# Altium project EXP_V100.PrjPcb
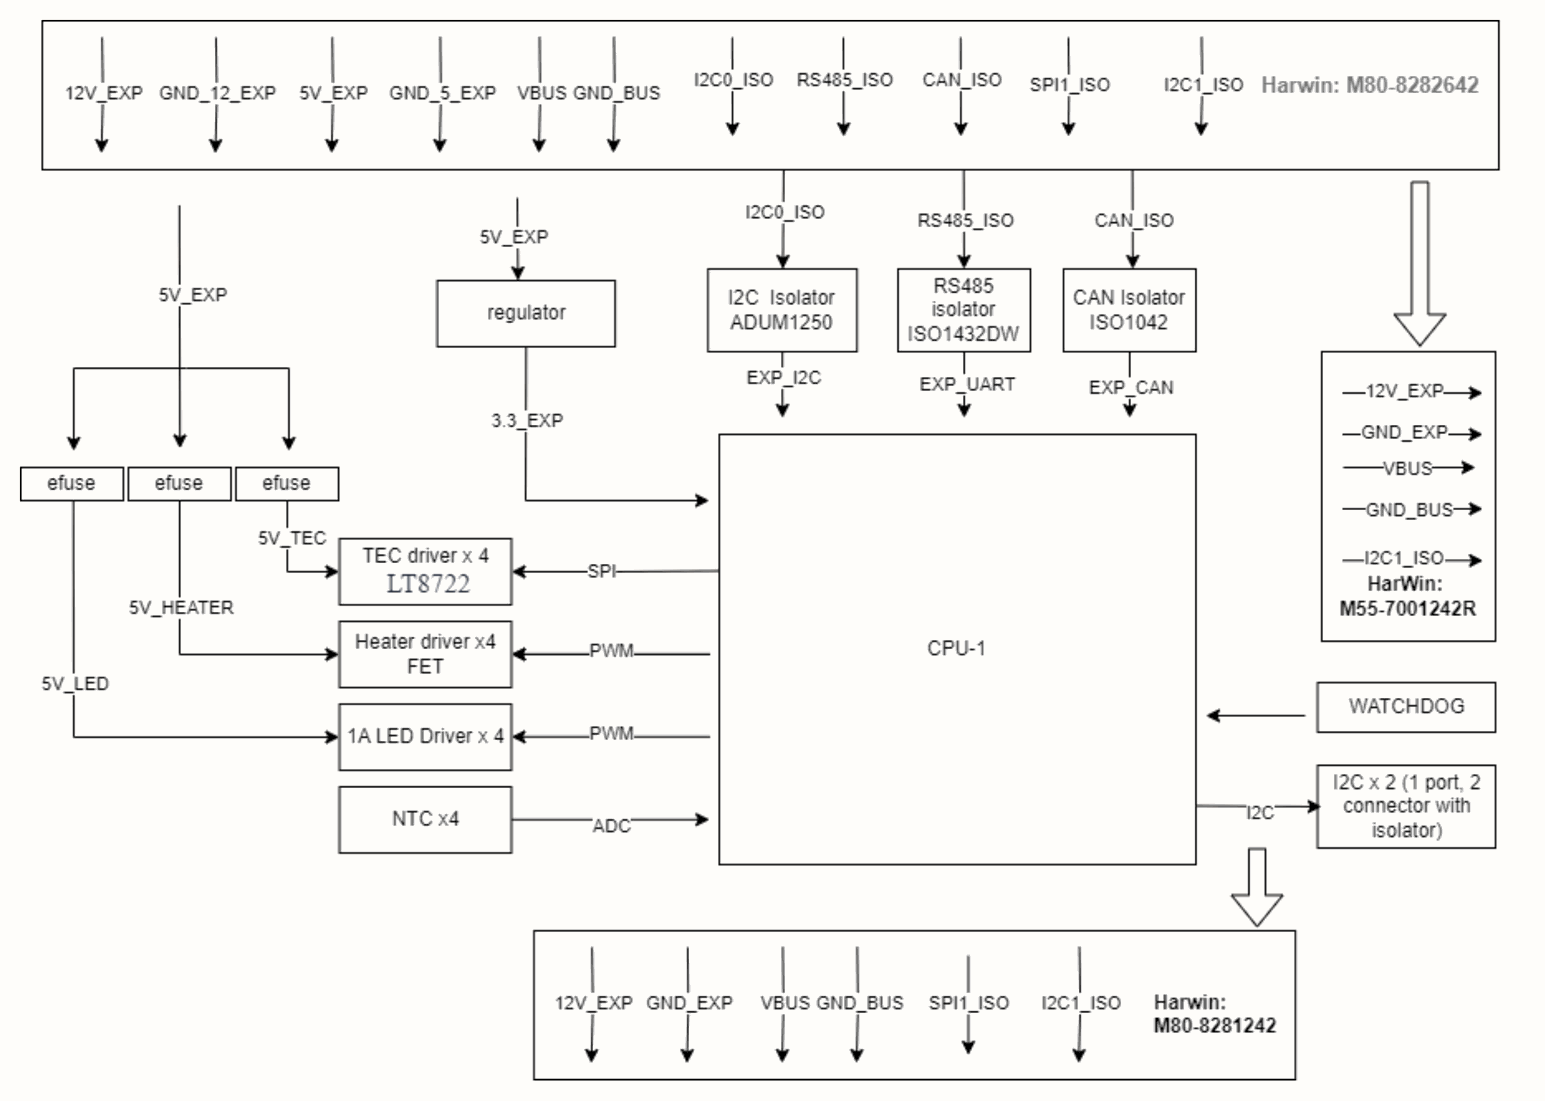
[diagram p0: BLOCK_DIAGRAM.SchDoc]
11 sheets, 411 parts. Net scope: global (net labels, ports and power ports of the same name join across sheets).
Board file: EXP_V100_1.PcbDoc
Sheets:
  BLOCK_DIAGRAM.SchDoc
  INDEX.SchDoc
  HEADERSchDoc.SchDoc
  POWERchDoc.SchDoc
  ISO_COMMUNICATION.SchDoc
  TECS_DRIVER.SchDoc
  HEATER.SchDoc
  NTC.SchDoc
  I2C_SENSOR.SchDoc
  LED.SchDoc
  MCU.SchDoc

## Sheet BLOCK_DIAGRAM.SchDoc: BLOCK_DIAGRAM
size 420 x 297 mm; SheetNumber: 1; SheetTotal: 11

### Notes on the sheet
- Project:
- BEE-PC1
- Sub-system:
- NANORACK_EXP_CONTROLLER
- Design by:
- SANG HUYNH
- BAO BUI Q.
- Sheet title:
- Sheet
- A3
- of
- Checked by:
- Approved by:
- VU PHAM
- Revision:
- Document No:
- V1.0.0
- Size:
- Date:
- 01/10/2024

## Sheet INDEX.SchDoc: INDEX
size 420 x 297 mm; CheckedBy: BAO BUI Q.; Author: SANG HUYNH; DocumentNumber: 1; Revision: V1.0.0; SheetNumber: 2; SheetTotal: 11
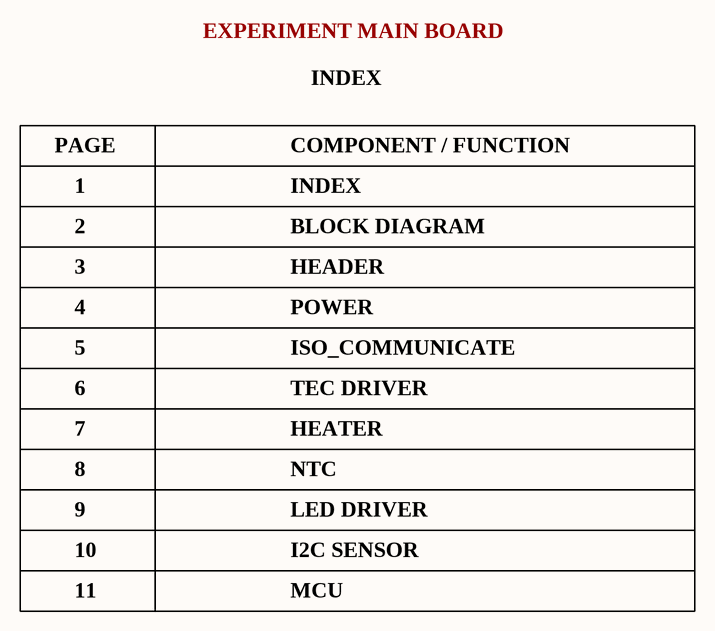
[diagram p1: INDEX.SchDoc]

### Notes on the sheet
- EXPERIMENT MAIN BOARD
- PAGE
- COMPONENT / FUNCTION
- INDEX
- 1
- 2
- 3
- BLOCK DIAGRAM
- HEADER
- 4
- POWER
- 5
- 6
- ISO_COMMUNICATE
- TEC DRIVER
- 7
- 8
- HEATER
- NTC
- 9
- 10
- LED DRIVER
- I2C SENSOR
- 11
- MCU
- Project:
- BEE-PC1
- Sub-system:
- NANORACK_EXP_CONTROLLER
- Design by:
- SANG HUYNH
- BAO BUI Q.
- Sheet title:
- Sheet
- A3
- of
- Checked by:
- Approved by:
- VU PHAM
- Revision:
- Document No:
- V1.0.0
- Size:
- Date:
- 01/10/2024

## Sheet HEADERSchDoc.SchDoc: HEADER
size 420 x 297 mm; SheetNumber: 3; SheetTotal: 11
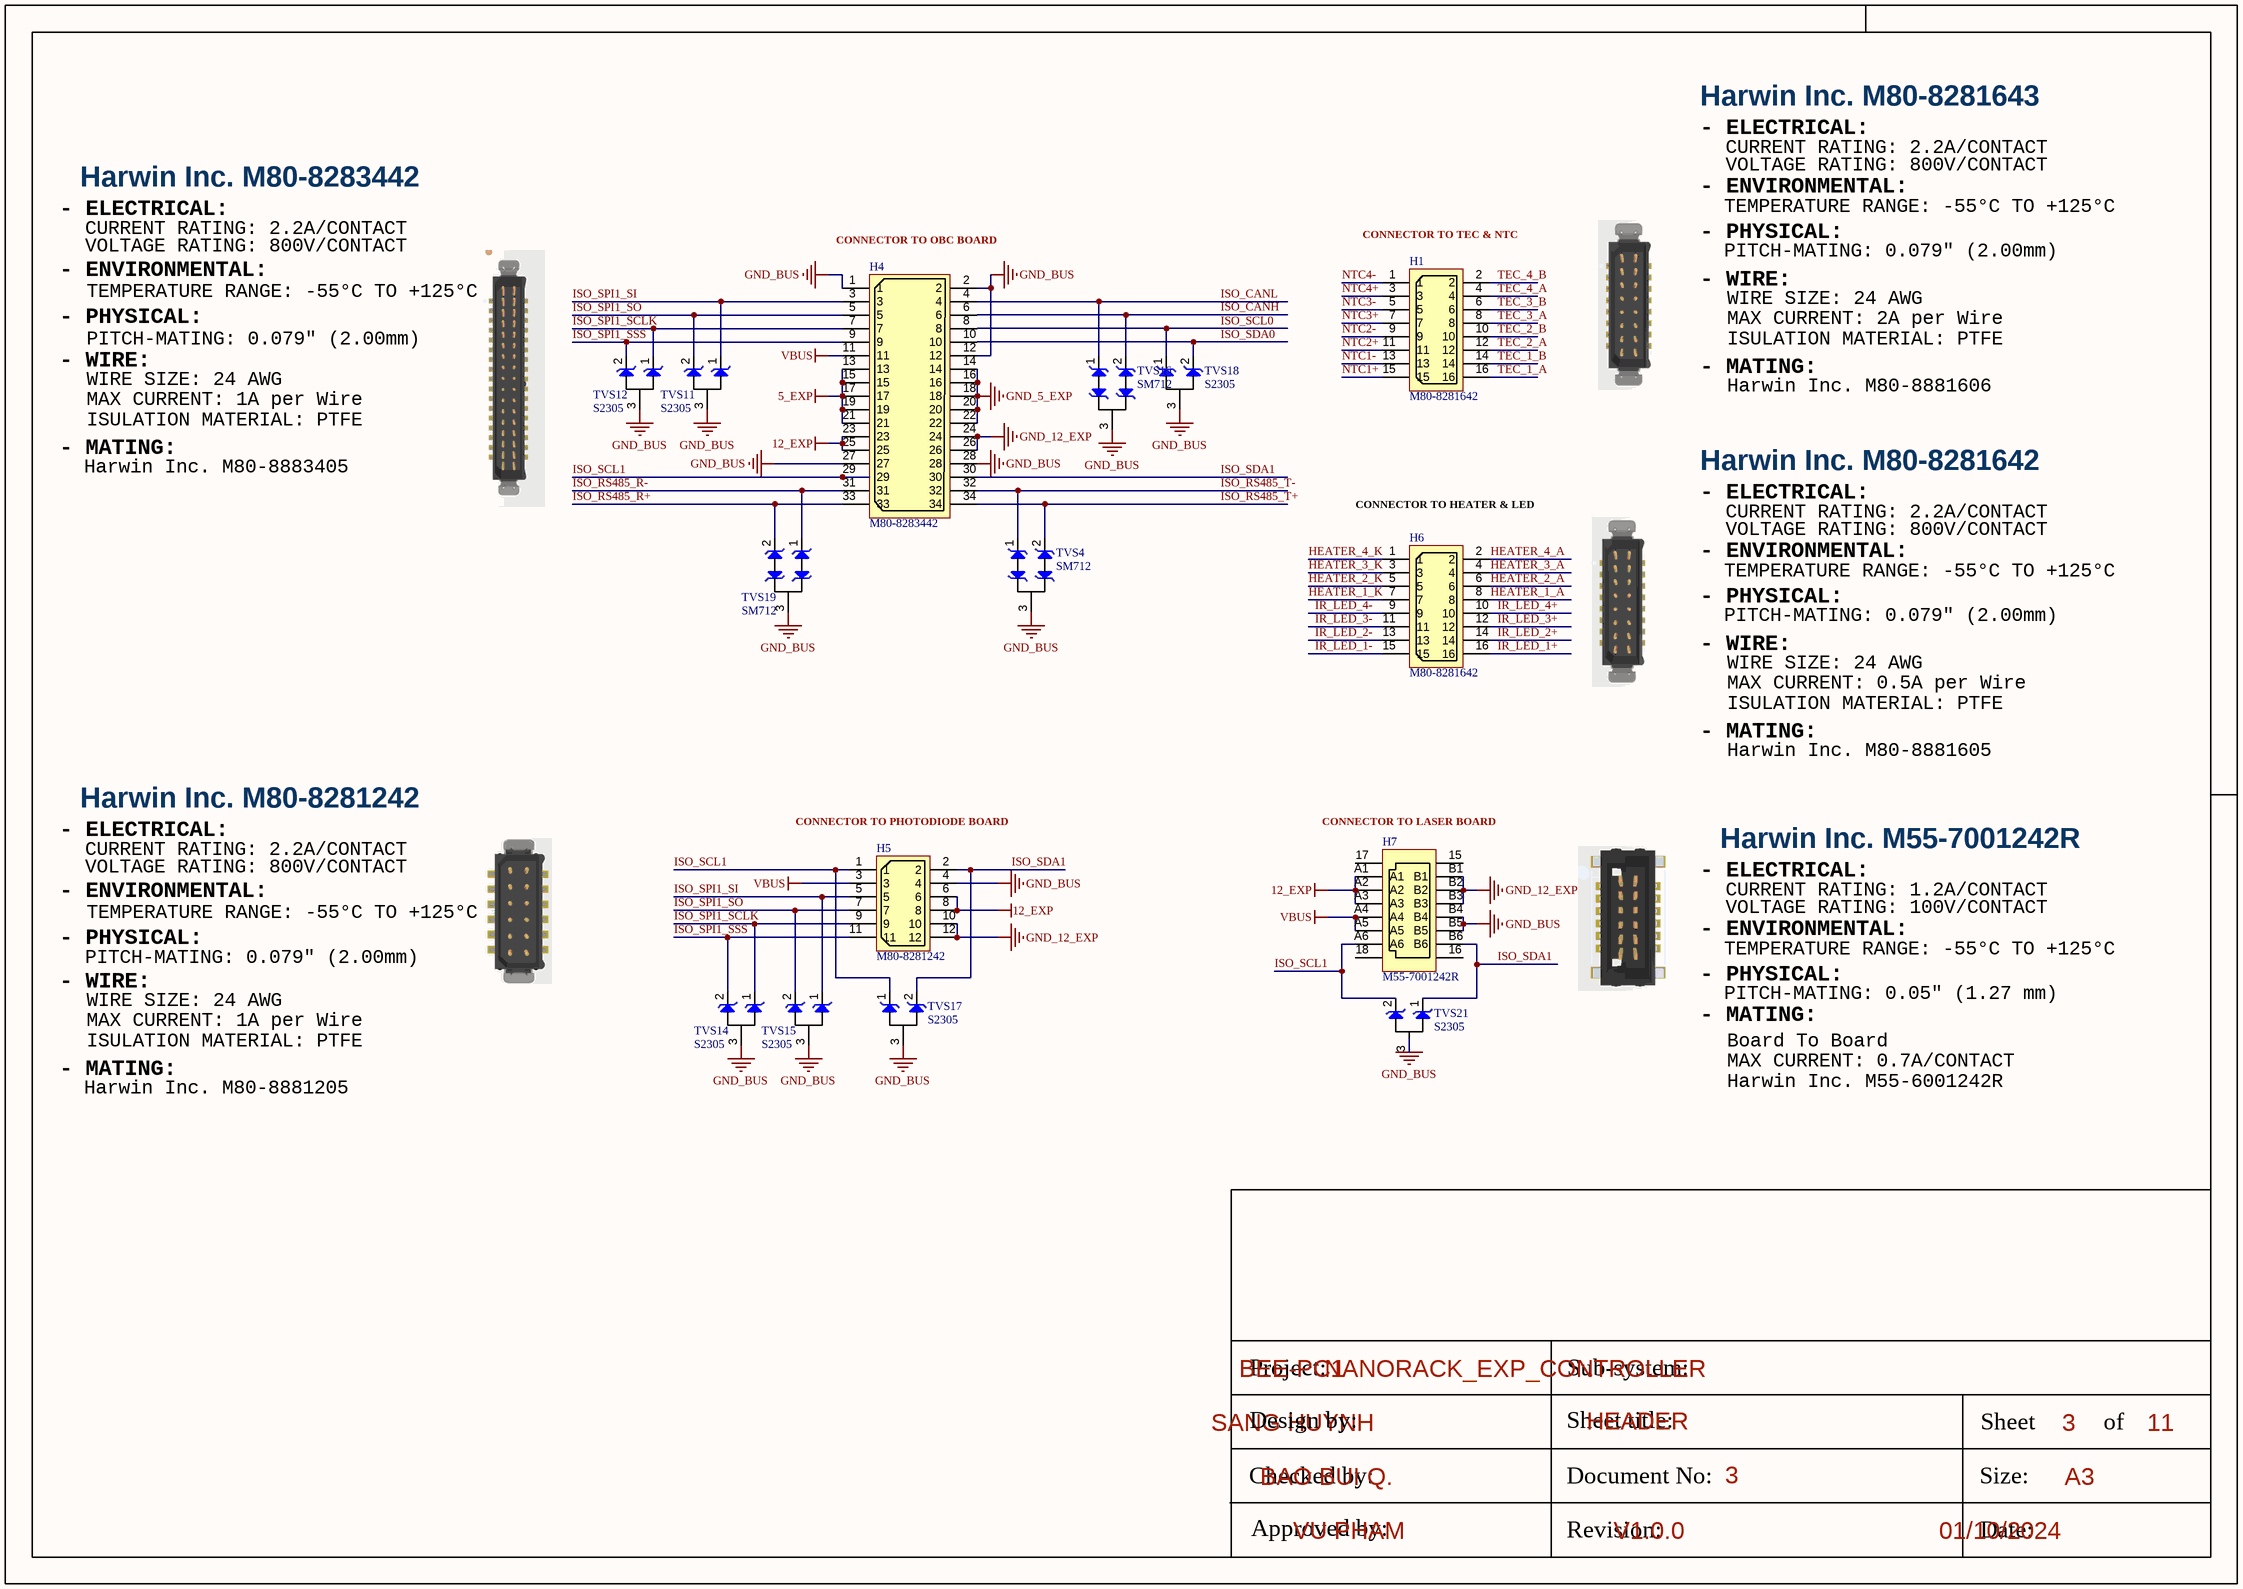
[diagram p2: HEADERSchDoc.SchDoc]

### Parts
H1  M80-8281642  [M80-8281642]
H4  M80-8283442  [M80-8283442]
H5  M80-8281242  [M80-8281242]
H6  M80-8281642  [M80-8281642]
H7  M55-7001242R  [M55-7001242R]
TVS4  SM712  [SOT23-12_3]
TVS11  S2305  [sot23-12_3]
TVS12  S2305  [sot23-12_3]
TVS14  S2305  [sot23-12_3]
TVS15  S2305  [sot23-12_3]
TVS16  SM712  [SOT23-12_3]
TVS17  S2305  [sot23-12_3]
TVS18  S2305  [sot23-12_3]
TVS19  SM712  [SOT23-12_3]
TVS21  S2305  [sot23-12_3]

### Nets
5_EXP: H4.13 H4.15 H4.17 H4.19 H4.21  [project net +5]
12_EXP: H4.23 H4.25 H5.6 H5.8 H7.A1 H7.A2 H7.A3
GND_5_EXP: H4.14 H4.16 H4.18 H4.20 H4.22  [project net GND]
GND_12_EXP: H4.24 H4.26 H5.10 H5.12 H7.B1 H7.B2 H7.B3
GND_BUS: H4.1 H4.2 H4.12 H4.27 H4.28 H5.4 H7.B4 H7.B5 TVS4.3 TVS11.3 TVS12.3 TVS14.3 TVS15.3 TVS16.3 TVS17.3 TVS18.3 TVS19.3 TVS21.3
NTC1+: H1.3 H1.7 H1.11 H1.15  [also labelled NTC2+, NTC3+, NTC4+]  [project net 3V3_EXP]
VBUS: H4.11 H5.3 H7.A4 H7.A5
HEATER_1_A: H6.8
HEATER_1_K: H6.7
HEATER_2_A: H6.6
HEATER_2_K: H6.5
HEATER_3_A: H6.4
HEATER_3_K: H6.3
HEATER_4_A: H6.2
HEATER_4_K: H6.1
IR_LED_1+: H6.16
IR_LED_1-: H6.15
IR_LED_2+: H6.14
IR_LED_2-: H6.13
IR_LED_3+: H6.12
IR_LED_3-: H6.11
IR_LED_4+: H6.10
IR_LED_4-: H6.9
ISO_CANH: H4.6 TVS16.2
ISO_CANL: H4.4 TVS16.1
ISO_RS485_R+: H4.33 TVS19.2
ISO_RS485_R-: H4.31 TVS19.1
ISO_RS485_T+: H4.34 TVS4.2
ISO_RS485_T-: H4.32 TVS4.1
ISO_SCL0: H4.8 TVS18.1
ISO_SCL1: H4.29 H5.1 H7.A6 TVS17.1 TVS21.2
ISO_SDA0: H4.10 TVS18.2
ISO_SDA1: H4.30 H5.2 H7.B6 TVS17.2 TVS21.1
ISO_SPI1_~{SSS}: H4.9 H5.11 TVS12.2 TVS14.2
ISO_SPI1_SCLK: H4.7 H5.9 TVS12.1 TVS14.1
ISO_SPI1_SI: H4.3 H5.5 TVS11.1 TVS15.1
ISO_SPI1_SO: H4.5 H5.7 TVS11.2 TVS15.2
NTC1-: H1.13
NTC2-: H1.9
NTC3-: H1.5
NTC4-: H1.1
TEC_1_A: H1.16
TEC_1_B: H1.14
TEC_2_A: H1.12
TEC_2_B: H1.10
TEC_3_A: H1.8
TEC_3_B: H1.6
TEC_4_A: H1.4
TEC_4_B: H1.2

Not connected (* = marked no-connect by the designer): H7 15 16 17 18

### Notes on the sheet
- Harwin Inc. M80-8281643
- Harwin Inc. M80-8283442
- - ELECTRICAL:
- - ENVIRONMENTAL:
- CURRENT RATING: 2.2A/CONTACT
- VOLTAGE RATING: 800V/CONTACT
- (near H4) CONNECTOR TO OBC BOARD
- (near H1) CONNECTOR TO TEC & NTC
- - PHYSICAL:
- TEMPERATURE RANGE: -55°C TO +125°C
- PITCH-MATING: 0.079" (2.00mm)
- - WIRE:
- WIRE SIZE: 24 AWG
- MAX CURRENT: 2A per Wire
- - MATING:
- Harwin Inc. M80-8881606
- ISULATION MATERIAL: PTFE
- MAX CURRENT: 1A per Wire
- Harwin Inc. M80-8883405
- (near H6) CONNECTOR TO HEATER & LED
- Harwin Inc. M80-8281642
- MAX CURRENT: 0.5A per Wire
- Harwin Inc. M80-8881605
- Harwin Inc. M80-8281242
- (near H5) CONNECTOR TO PHOTODIODE BOARD
- (near H7) CONNECTOR TO LASER BOARD
- Harwin Inc. M55-7001242R
- CURRENT RATING: 1.2A/CONTACT
- VOLTAGE RATING: 100V/CONTACT
- PITCH-MATING: 0.05" (1.27 mm)
- Board To Board
- MAX CURRENT: 0.7A/CONTACT
- Harwin Inc. M80-8881205
- Harwin Inc. M55-6001242R
- Project:
- BEE-PC1
- Sub-system:
- NANORACK_EXP_CONTROLLER
- Design by:
- SANG HUYNH
- BAO BUI Q.
- Sheet title:
- Sheet
- A3
- of
- Checked by:
- Approved by:
- VU PHAM
- Revision:
- Document No:
- V1.0.0
- Size:
- Date:
- 01/10/2024

### Library data of the parts
H1 H6 = M80-8281642: CONN HEADER SMD 16POS 2MM
H4 = M80-8283442: CONN HEADER SMD 34POS 2MM
H5 = M80-8281242: CONN HEADER SMD 12POS 2MM
H7 = M55-7001242R: CONN HEADER SMD 12POS 1.27MM
TVS4 TVS16 TVS19 = SM712: 7V/12V TVS,PACKAGE SOT-23, TVS A
TVS11 TVS12 TVS14 TVS15 TVS17 TVS18 TVS21 = S2305: TVS DIODE 5VWM 10.8VC SOT23

## Sheet POWERchDoc.SchDoc: POWER
size 420 x 297 mm; SheetNumber: 4; SheetTotal: 11
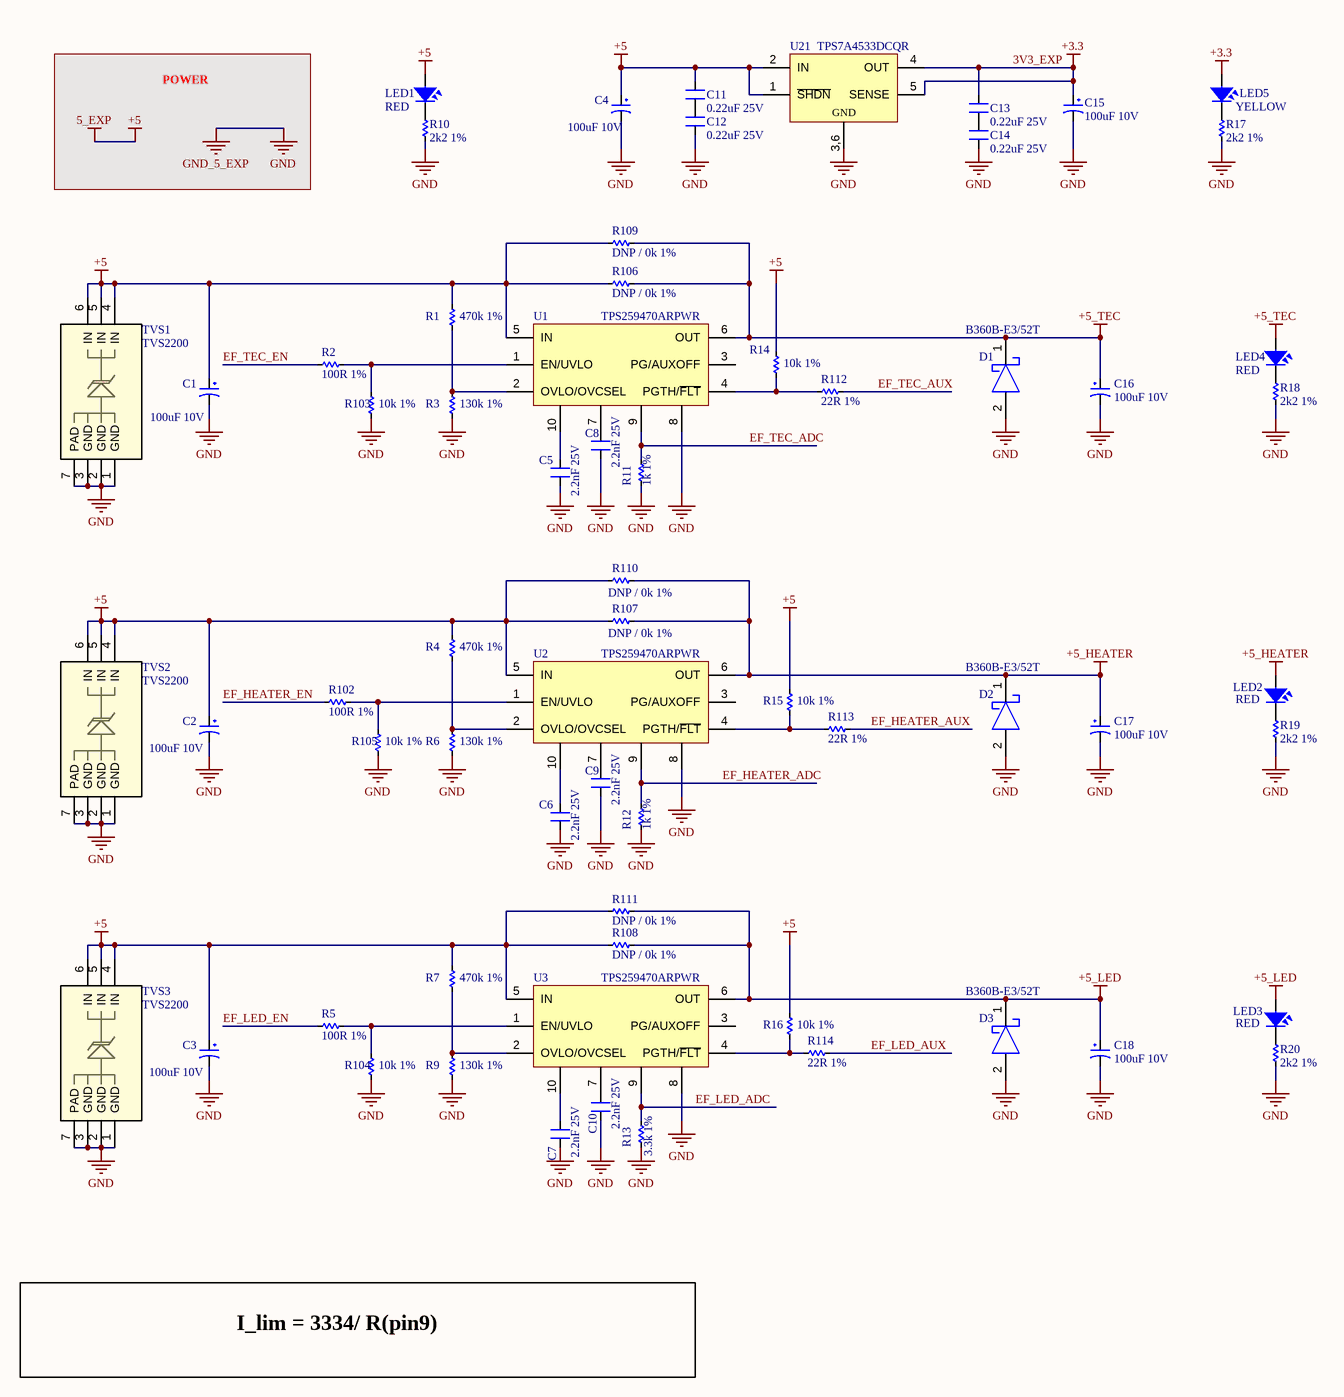
[diagram p3: POWERchDoc.SchDoc]

### Parts
C1  100uF 10V  [TANTALUM_SMD_1206]
C2  100uF 10V  [TANTALUM_SMD_1206]
C3  100uF 10V  [TANTALUM_SMD_1206]
C4  100uF 10V  [TANTALUM_SMD_1206]
C5  2.2nF 25V  [CN-SMD-0603]
C6  2.2nF 25V  [CN-SMD-0603]
C7  2.2nF 25V  [CN-SMD-0603]
C8  2.2nF 25V  [CN-SMD-0603]
C9  2.2nF 25V  [CN-SMD-0603]
C10  2.2nF 25V  [CN-SMD-0603]
C11  0.22uF 25V  [CN-SMD-0603]
C12  0.22uF 25V  [CN-SMD-0603]
C13  0.22uF 25V  [CN-SMD-0603]
C14  0.22uF 25V  [CN-SMD-0603]
C15  100uF 10V  [TANTALUM_SMD_1206]
C16  100uF 10V  [TANTALUM_SMD_1206]
C17  100uF 10V  [TANTALUM_SMD_1206]
C18  100uF 10V  [TANTALUM_SMD_1206]
D1  B360B-E3/52T  [DO214]
D2  B360B-E3/52T  [DO214]
D3  B360B-E3/52T  [DO214]
LED1  RED  [LED_0603_RED]
LED2  RED  [LED_0603_RED]
LED3  RED  [LED_0603_RED]
LED4  RED  [LED_0603_RED]
LED5  YELLOW  [LED_0603_RED]
R1  470k 1%  [RES-SMD-0603]
R2  100R 1%  [RES-SMD-0603]
R3  130k 1%  [RES-SMD-0603]
R4  470k 1%  [RES-SMD-0603]
R5  100R 1%  [RES-SMD-0603]
R6  130k 1%  [RES-SMD-0603]
R7  470k 1%  [RES-SMD-0603]
R9  130k 1%  [RES-SMD-0603]
R10  2k2 1%  [RES-SMD-0603]
R11  1k 1%  [RES-SMD-0603]
R12  1k 1%  [RES-SMD-0603]
R13  3.3k 1%  [RES-SMD-0603]
R14  10k 1%  [RES-SMD-0603]
R15  10k 1%  [RES-SMD-0603]
R16  10k 1%  [RES-SMD-0603]
R17  2k2 1%  [RES-SMD-0603]
R18  2k2 1%  [RES-SMD-0603]
R19  2k2 1%  [RES-SMD-0603]
R20  2k2 1%  [RES-SMD-0603]
R102  100R 1%  [RES-SMD-0603]
R103  10k 1%  [RES-SMD-0603]
R104  10k 1%  [RES-SMD-0603]
R105  10k 1%  [RES-SMD-0603]
R106  DNP / 0k 1%  [RES-SMD-0603]
R107  DNP / 0k 1%  [RES-SMD-0603]
R108  DNP / 0k 1%  [RES-SMD-0603]
R109  DNP / 0k 1%  [RES-SMD-0603]
R110  DNP / 0k 1%  [RES-SMD-0603]
R111  DNP / 0k 1%  [RES-SMD-0603]
R112  22R 1%  [RES-SMD-0603]
R113  22R 1%  [RES-SMD-0603]
R114  22R 1%  [RES-SMD-0603]
TVS1  TVS2200  [TVS2200]
TVS2  TVS2200  [TVS2200]
TVS3  TVS2200  [TVS2200]
U1  TPS259470ARPWR  [VQFN-HR-10]
U2  TPS259470ARPWR  [VQFN-HR-10]
U3  TPS259470ARPWR  [VQFN-HR-10]
U21  TPS7A4533DCQR  [SOT223_6]

### Nets
3V3_EXP: C13.2 C15.1 LED5.1 U21.4(OUT) U21.5(SENSE)  [also labelled +3.3]
+5: C1.1 C2.1 C3.1 C4.1 C11.2 LED1.1 R1.1 R4.1 R7.1 R14.1 R15.1 R16.1 R106.2 R107.2 R108.2 R109.2 R110.2 R111.2 TVS1.4(IN) TVS1.5(IN) TVS1.6(IN) TVS2.4(IN) TVS2.5(IN) TVS2.6(IN) TVS3.4(IN) TVS3.5(IN) TVS3.6(IN) U1.5(IN) U2.5(IN) U3.5(IN) U21.1(~{SHDN}) U21.2(IN)  [also labelled 5_EXP]
+5_HEATER: C17.1 D2.1 LED2.1 R107.1 R110.1 U2.6(OUT)
+5_LED: C18.1 D3.1 LED3.1 R108.1 R111.1 U3.6(OUT)
+5_TEC: C16.1 D1.1 LED4.1 R106.1 R109.1 U1.6(OUT)
GND: C1.2 C2.2 C3.2 C4.2 C5.1 C6.1 C7.1 C8.1 C9.1 C10.1 C12.1 C14.1 C15.2 C16.2 C17.2 C18.2 D1.2 D2.2 D3.2 R3.2 R6.2 R9.2 R10.2 R11.2 R12.2 R13.2 R17.2 R18.2 R19.2 R20.2 R103.2 R104.2 R105.2 TVS1.1(GND) TVS1.2(GND) TVS1.3(GND) TVS1.7(PAD) TVS2.1(GND) TVS2.2(GND) TVS2.3(GND) TVS2.7(PAD) TVS3.1(GND) TVS3.2(GND) TVS3.3(GND) TVS3.7(PAD) U1.8 U2.8 U3.8 U21.3,6(GND)  [also labelled GND_5_EXP]
EF_HEATER_ADC: R12.1 U2.9
EF_HEATER_AUX: R113.2
EF_HEATER_EN: R102.1
EF_LED_ADC: R13.1 U3.9
EF_LED_AUX: R114.2
EF_LED_EN: R5.1
EF_TEC_ADC: R11.1 U1.9
EF_TEC_AUX: R112.2
EF_TEC_EN: R2.1
NetC5_2: C5.2 U1.10
NetC6_2: C6.2 U2.10
NetC7_2: C7.2 U3.10
NetC8_2: C8.2 U1.7
NetC9_2: C9.2 U2.7
NetC10_2: C10.2 U3.7
NetC11_1: C11.1 C12.2
NetC13_1: C13.1 C14.2
NetLED1_2: LED1.2 R10.1
NetLED2_2: LED2.2 R19.1
NetLED3_2: LED3.2 R20.1
NetLED4_2: LED4.2 R18.1
NetLED5_2: LED5.2 R17.1
NetR1_2: R1.2 R3.1 U1.2(OVLO/OVCSEL)
NetR2_2: R2.2 R103.1 U1.1(EN/UVLO)
NetR4_2: R4.2 R6.1 U2.2(OVLO/OVCSEL)
NetR5_2: R5.2 R104.1 U3.1(EN/UVLO)
NetR7_2: R7.2 R9.1 U3.2(OVLO/OVCSEL)
NetR14_2: R14.2 R112.1 U1.4(PGTH/~{FLT})
NetR15_2: R15.2 R113.1 U2.4(PGTH/~{FLT})
NetR16_2: R16.2 R114.1 U3.4(PGTH/~{FLT})
NetR102_2: R102.2 R105.1 U2.1(EN/UVLO)

Not connected (* = marked no-connect by the designer): U1 3(PG/AUXOFF); U2 3(PG/AUXOFF); U3 3(PG/AUXOFF)

### Notes on the sheet
- POWER
- I_lim = 3334/ R(pin9)
- Project:
- BEE-PC1
- Sub-system:
- NANORACK_EXP_CONTROLLER
- Design by:
- SANG HUYNH
- BAO BUI Q.
- Sheet title:
- Sheet
- A3
- of
- Checked by:
- Approved by:
- VU PHAM
- Revision:
- Document No:
- V1.0.0
- Size:
- Date:
- 01/10/2024

### Library data of the parts
C1-C4 C15-C18 = Cap_Tantalum SMD: SMD; Chung_Loai: Dán; Don_Vi: Con; So_Chan: 2; Ten_Linh_Kien: Tụ tantalum 477A-470uF 10V SMD7343; Ma_Hang: MH001956; Kieu_Chan: *
C5-C14 = Capacitors: Value: 33pF
D1-D3 = B360B-E3/52T: DIODE SCHOTTKY 60V 3A DO214AA
LED1-LED5 = LED SMD: Value: LED 3 - 5 ly 2 Colour
R1-R7 R9-R20 R102-R114 = Res SMD: SMD; Manufacturer: Generic Components; Class: Passive; Published: 08/06/2000; Publisher: Altium Hobart Technology Centre
TVS1-TVS3 = TVS2200: UNIDIR PRECISION SURGE DIODE
U21 = TPS7A4533DCQR: IC REG LINEAR 3.3V 1.5A SOT223-6

## Sheet ISO_COMMUNICATION.SchDoc: ISO_COMMUNICATION
size 420 x 297 mm; SheetNumber: 5; SheetTotal: 11
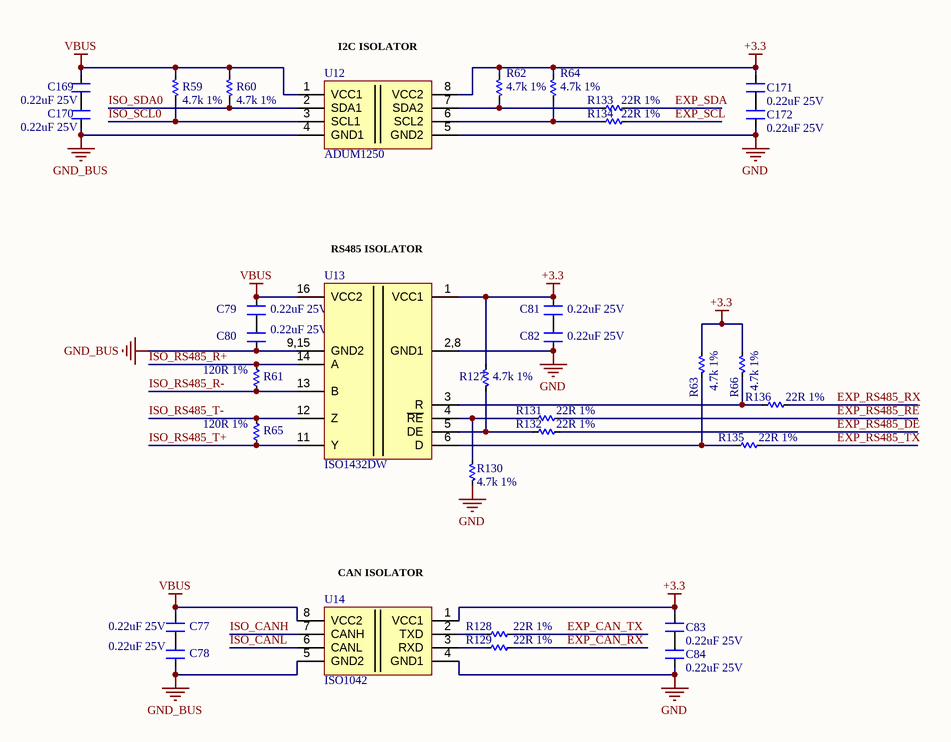
[diagram p4: ISO_COMMUNICATION.SchDoc]

### Parts
C77  0.22uF 25V  [CN-SMD-0603]
C78  0.22uF 25V  [CN-SMD-0603]
C79  0.22uF 25V  [CN-SMD-0603]
C80  0.22uF 25V  [CN-SMD-0603]
C81  0.22uF 25V  [CN-SMD-0603]
C82  0.22uF 25V  [CN-SMD-0603]
C83  0.22uF 25V  [CN-SMD-0603]
C84  0.22uF 25V  [CN-SMD-0603]
C169  0.22uF 25V  [CN-SMD-0603]
C170  0.22uF 25V  [CN-SMD-0603]
C171  0.22uF 25V  [CN-SMD-0603]
C172  0.22uF 25V  [CN-SMD-0603]
R59  4.7k 1%  [RES-SMD-0603]
R60  4.7k 1%  [RES-SMD-0603]
R61  120R 1%  [RES-SMD-0603]
R62  4.7k 1%  [RES-SMD-0603]
R63  4.7k 1%  [RES-SMD-0603]
R64  4.7k 1%  [RES-SMD-0603]
R65  120R 1%  [RES-SMD-0603]
R66  4.7k 1%  [RES-SMD-0603]
R127  4.7k 1%  [RES-SMD-0603]
R128  22R 1%  [RES-SMD-0603]
R129  22R 1%  [RES-SMD-0603]
R130  4.7k 1%  [RES-SMD-0603]
R131  22R 1%  [RES-SMD-0603]
R132  22R 1%  [RES-SMD-0603]
R133  22R 1%  [RES-SMD-0603]
R134  22R 1%  [RES-SMD-0603]
R135  22R 1%  [RES-SMD-0603]
R136  22R 1%  [RES-SMD-0603]
U12  ADUM1250  [SOIC-8]
U13  ISO1432DW  [SOIC-16]
U14  ISO1042  [SOIC-8]

### Nets
+3.3: C81.2 C83.2 C171.2 R62.2 R63.2 R64.2 R66.2 R127.2 U12.8(VCC2) U13.1(VCC1) U14.1(VCC1)  [project net 3V3_EXP]
GND: C82.1 C84.1 C172.1 R130.2 U12.5(GND2) U13.2,8(GND1) U14.4(GND1)
GND_BUS: C78.1 C80.1 C170.1 U12.4(GND1) U13.9,15(GND2) U14.5(GND2)
VBUS: C77.2 C79.2 C169.2 R59.2 R60.2 U12.1(VCC1) U13.16(VCC2) U14.8(VCC2)
EXP_CAN_RX: R129.2
EXP_CAN_TX: R128.2
EXP_RS485_DE: R132.2
EXP_RS485_~{RE}: R131.2
EXP_RS485_RX: R136.2
EXP_RS485_TX: R135.2
EXP_SCL: R134.2
EXP_SDA: R133.2
ISO_CANH: U14.7(CANH)
ISO_CANL: U14.6(CANL)
ISO_RS485_R+: R61.2 U13.14(A)
ISO_RS485_R-: R61.1 U13.13(B)
ISO_RS485_T+: R65.1 U13.11(Y)
ISO_RS485_T-: R65.2 U13.12(Z)
ISO_SCL0: R59.1 U12.3(SCL1)
ISO_SDA0: R60.1 U12.2(SDA1)
NetC77_1: C77.1 C78.2
NetC79_1: C79.1 C80.2
NetC81_1: C81.1 C82.2
NetC83_1: C83.1 C84.2
NetC169_1: C169.1 C170.2
NetC171_1: C171.1 C172.2
NetR62_1: R62.1 R133.1 U12.7(SDA2)
NetR63_1: R63.1 R135.1 U13.6(D)
NetR64_1: R64.1 R134.1 U12.6(SCL2)
NetR66_1: R66.1 R136.1 U13.3(R)
NetR127_1: R127.1 R132.1 U13.5(DE)
NetR128_1: R128.1 U14.2(TXD)
NetR129_1: R129.1 U14.3(RXD)
NetR130_1: R130.1 R131.1 U13.4(~{RE})

### Notes on the sheet
- (near U12) I2C ISOLATOR
- (near U13) RS485 ISOLATOR
- (near U14) CAN ISOLATOR
- Project:
- BEE-PC1
- Sub-system:
- NANORACK_EXP_CONTROLLER
- Design by:
- SANG HUYNH
- BAO BUI Q.
- Sheet title:
- Sheet
- A3
- of
- Checked by:
- Approved by:
- VU PHAM
- Revision:
- Document No:
- V1.0.0
- Size:
- Date:
- 01/10/2024

### Library data of the parts
C77-C84 C169-C172 = Capacitors: Value: 33pF
R59-R66 R127-R136 = Res SMD: as R1 on sheet POWERchDoc; Published: 08/06/2000; Publisher: Altium Hobart Technology Centre
U13 = ISO1432DW: IC TXRX/ISO FULL 1/1 16SOIC
U14 = ISO1042: IC TRANSCEIVER FULL 1/1 8SOIC

## Sheet TECS_DRIVER.SchDoc: TEC_DRIVER
size 420 x 297 mm; SheetNumber: 6; SheetTotal: 11
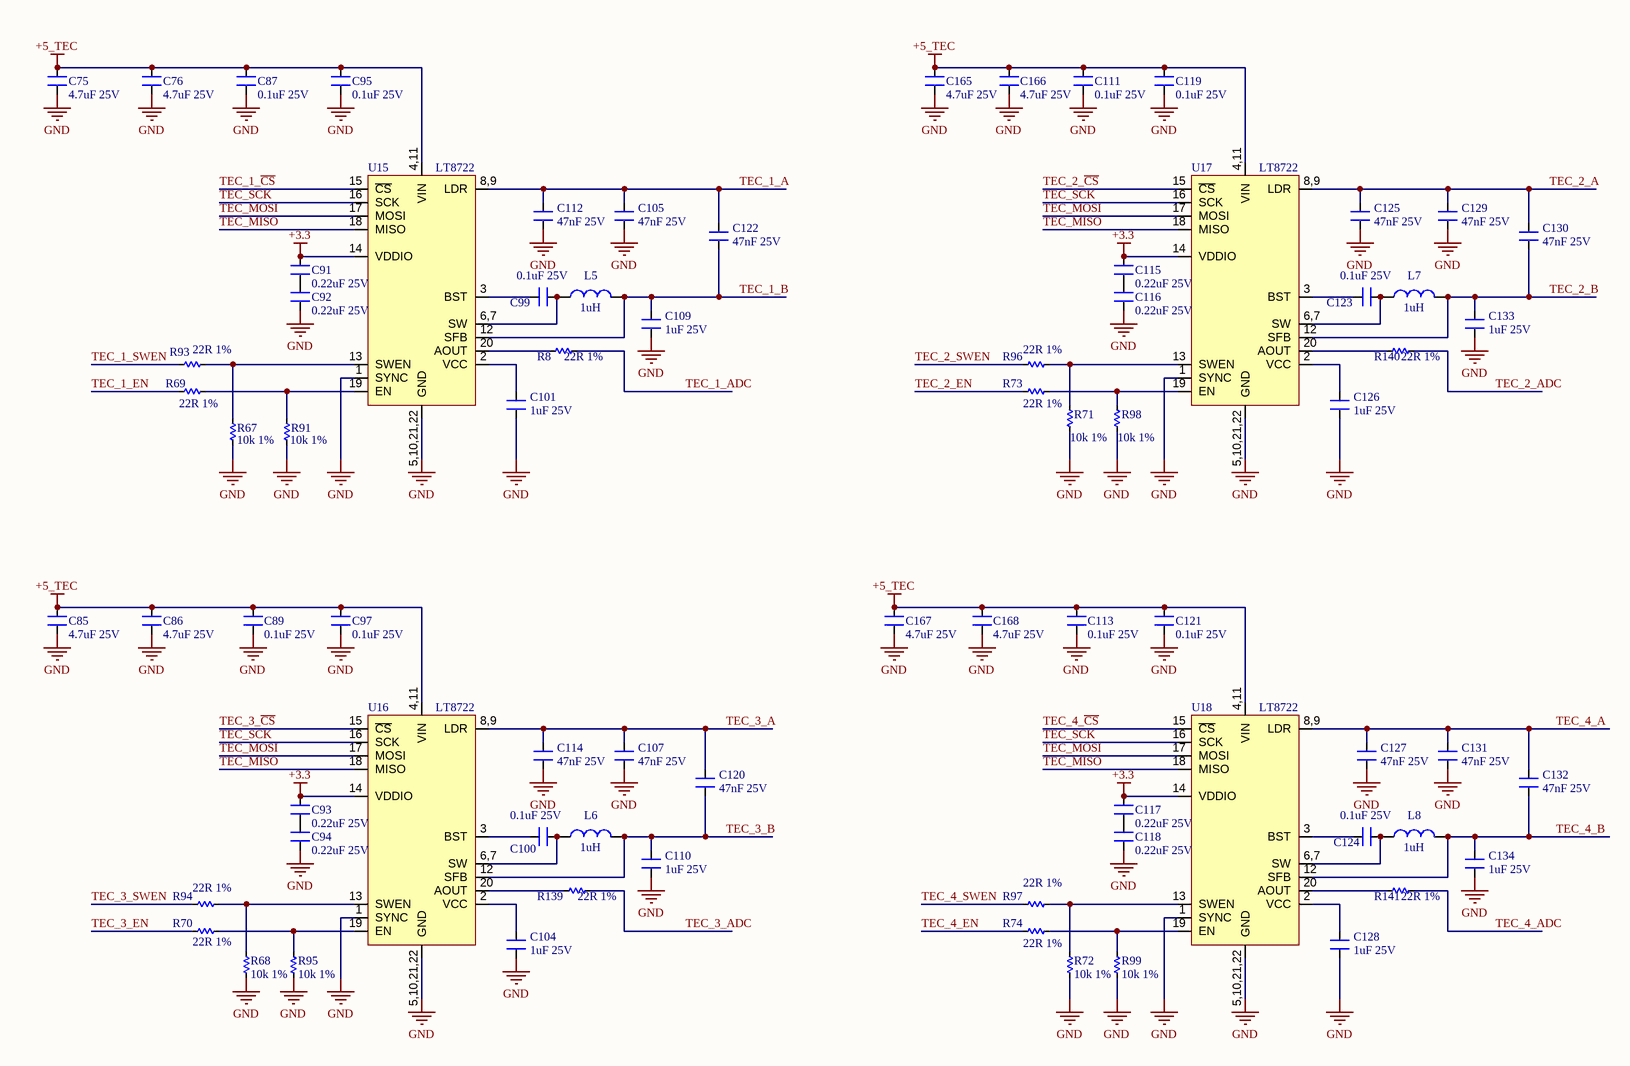
[diagram p5: TECS_DRIVER.SchDoc]

### Parts
C75  4.7uF 25V  [CN-SMD-0603]
C76  4.7uF 25V  [CN-SMD-0603]
C85  4.7uF 25V  [CN-SMD-0603]
C86  4.7uF 25V  [CN-SMD-0603]
C87  0.1uF 25V  [CN-SMD-0603]
C89  0.1uF 25V  [CN-SMD-0603]
C91  0.22uF 25V  [CN-SMD-0603]
C92  0.22uF 25V  [CN-SMD-0603]
C93  0.22uF 25V  [CN-SMD-0603]
C94  0.22uF 25V  [CN-SMD-0603]
C95  0.1uF 25V  [CN-SMD-0603]
C97  0.1uF 25V  [CN-SMD-0603]
C99  0.1uF 25V  [CN-SMD-0603]
C100  0.1uF 25V  [CN-SMD-0603]
C101  1uF 25V  [CN-SMD-0603]
C104  1uF 25V  [CN-SMD-0603]
C105  47nF 25V  [CN-SMD-0603]
C107  47nF 25V  [CN-SMD-0603]
C109  1uF 25V  [CN-SMD-0603]
C110  1uF 25V  [CN-SMD-0603]
C111  0.1uF 25V  [CN-SMD-0603]
C112  47nF 25V  [CN-SMD-0603]
C113  0.1uF 25V  [CN-SMD-0603]
C114  47nF 25V  [CN-SMD-0603]
C115  0.22uF 25V  [CN-SMD-0603]
C116  0.22uF 25V  [CN-SMD-0603]
C117  0.22uF 25V  [CN-SMD-0603]
C118  0.22uF 25V  [CN-SMD-0603]
C119  0.1uF 25V  [CN-SMD-0603]
C120  47nF 25V  [CN-SMD-0603]
C121  0.1uF 25V  [CN-SMD-0603]
C122  47nF 25V  [CN-SMD-0603]
C123  0.1uF 25V  [CN-SMD-0603]
C124  0.1uF 25V  [CN-SMD-0603]
C125  47nF 25V  [CN-SMD-0603]
C126  1uF 25V  [CN-SMD-0603]
C127  47nF 25V  [CN-SMD-0603]
C128  1uF 25V  [CN-SMD-0603]
C129  47nF 25V  [CN-SMD-0603]
C130  47nF 25V  [CN-SMD-0603]
C131  47nF 25V  [CN-SMD-0603]
C132  47nF 25V  [CN-SMD-0603]
C133  1uF 25V  [CN-SMD-0603]
C134  1uF 25V  [CN-SMD-0603]
C165  4.7uF 25V  [CN-SMD-0603]
C166  4.7uF 25V  [CN-SMD-0603]
C167  4.7uF 25V  [CN-SMD-0603]
C168  4.7uF 25V  [CN-SMD-0603]
L5  1uH  [L-SMD-M-3.5x3.5x2mm]
L6  1uH  [L-SMD-M-3.5x3.5x2mm]
L7  1uH  [L-SMD-M-3.5x3.5x2mm]
L8  1uH  [L-SMD-M-3.5x3.5x2mm]
R8  22R 1%  [RES-SMD-0603]
R67  10k 1%  [RES-SMD-0603]
R68  10k 1%  [RES-SMD-0603]
R69  22R 1%  [RES-SMD-0603]
R70  22R 1%  [RES-SMD-0603]
R71  10k 1%  [RES-SMD-0603]
R72  10k 1%  [RES-SMD-0603]
R73  22R 1%  [RES-SMD-0603]
R74  22R 1%  [RES-SMD-0603]
R91  10k 1%  [RES-SMD-0603]
R93  22R 1%  [RES-SMD-0603]
R94  22R 1%  [RES-SMD-0603]
R95  10k 1%  [RES-SMD-0603]
R96  22R 1%  [RES-SMD-0603]
R97  22R 1%  [RES-SMD-0603]
R98  10k 1%  [RES-SMD-0603]
R99  10k 1%  [RES-SMD-0603]
R139  22R 1%  [RES-SMD-0603]
R140  22R 1%  [RES-SMD-0603]
R141  22R 1%  [RES-SMD-0603]
U15  LT8722  [QFN18]
U16  LT8722  [QFN18]
U17  LT8722  [QFN18]
U18  LT8722  [QFN18]

### Nets
+3.3: C91.2 C93.2 C115.2 C117.2 U15.14(VDDIO) U16.14(VDDIO) U17.14(VDDIO) U18.14(VDDIO)  [project net 3V3_EXP]
+5_TEC: C75.2 C76.2 C85.2 C86.2 C87.2 C89.2 C95.2 C97.2 C111.2 C113.2 C119.2 C121.2 C165.2 C166.2 C167.2 C168.2 U15.4,11(VIN) U16.4,11(VIN) U17.4,11(VIN) U18.4,11(VIN)
GND: C75.1 C76.1 C85.1 C86.1 C87.1 C89.1 C92.1 C94.1 C95.1 C97.1 C101.1 C104.1 C105.1 C107.1 C109.1 C110.1 C111.1 C112.1 C113.1 C114.1 C116.1 C118.1 C119.1 C121.1 C125.1 C126.1 C127.1 C128.1 C129.1 C131.1 C133.1 C134.1 C165.1 C166.1 C167.1 C168.1 R67.2 R68.1 R71.2 R72.1 R91.2 R95.1 R98.2 R99.1 U15.1(SYNC) U15.5,10,21,22(GND) U16.1(SYNC) U16.5,10,21,22(GND) U17.1(SYNC) U17.5,10,21,22(GND) U18.1(SYNC) U18.5,10,21,22(GND)
TEC_1_A: C105.2 C112.2 C122.2 U15.8,9(LDR)
TEC_1_ADC: R8.2
TEC_1_B: C109.2 C122.1 L5.2 U15.12(SFB)
TEC_1_~{CS}: U15.15(~{CS})
TEC_1_EN: R69.1
TEC_1_SWEN: R93.1
TEC_2_A: C125.2 C129.2 C130.2 U17.8,9(LDR)
TEC_2_ADC: R140.2
TEC_2_B: C130.1 C133.2 L7.2 U17.12(SFB)
TEC_2_~{CS}: U17.15(~{CS})
TEC_2_EN: R73.1
TEC_2_SWEN: R96.1
TEC_3_A: C107.2 C114.2 C120.2 U16.8,9(LDR)
TEC_3_ADC: R139.2
TEC_3_B: C110.2 C120.1 L6.2 U16.12(SFB)
TEC_3_~{CS}: U16.15(~{CS})
TEC_3_EN: R70.1
TEC_3_SWEN: R94.1
TEC_4_A: C127.2 C131.2 C132.2 U18.8,9(LDR)
TEC_4_ADC: R141.2
TEC_4_B: C132.1 C134.2 L8.2 U18.12(SFB)
TEC_4_~{CS}: U18.15(~{CS})
TEC_4_EN: R74.1
TEC_4_SWEN: R97.1
TEC_MISO: U15.18(MISO) U16.18(MISO) U17.18(MISO) U18.18(MISO)
TEC_MOSI: U15.17(MOSI) U16.17(MOSI) U17.17(MOSI) U18.17(MOSI)
TEC_SCK: U15.16(SCK) U16.16(SCK) U17.16(SCK) U18.16(SCK)
NetC91_1: C91.1 C92.2
NetC93_1: C93.1 C94.2
NetC99_1: C99.1 L5.1 U15.6,7(SW)
NetC99_2: C99.2 U15.3(BST)
NetC100_1: C100.1 L6.1 U16.6,7(SW)
NetC100_2: C100.2 U16.3(BST)
NetC101_2: C101.2 U15.2(VCC)
NetC104_2: C104.2 U16.2(VCC)
NetC115_1: C115.1 C116.2
NetC117_1: C117.1 C118.2
NetC123_1: C123.1 L7.1 U17.6,7(SW)
NetC123_2: C123.2 U17.3(BST)
NetC124_1: C124.1 L8.1 U18.6,7(SW)
NetC124_2: C124.2 U18.3(BST)
NetC126_2: C126.2 U17.2(VCC)
NetC128_2: C128.2 U18.2(VCC)
NetR8_1: R8.1 U15.20(AOUT)
NetR67_1: R67.1 R93.2 U15.13(SWEN)
NetR68_2: R68.2 R94.2 U16.13(SWEN)
NetR69_2: R69.2 R91.1 U15.19(EN)
NetR70_2: R70.2 R95.2 U16.19(EN)
NetR71_1: R71.1 R96.2 U17.13(SWEN)
NetR72_2: R72.2 R97.2 U18.13(SWEN)
NetR73_2: R73.2 R98.1 U17.19(EN)
NetR74_2: R74.2 R99.2 U18.19(EN)
NetR139_1: R139.1 U16.20(AOUT)
NetR140_1: R140.1 U17.20(AOUT)
NetR141_1: R141.1 U18.20(AOUT)

### Notes on the sheet
- Project:
- BEE-PC1
- Sub-system:
- NANORACK_EXP_CONTROLLER
- Design by:
- SANG HUYNH
- BAO BUI Q.
- Sheet title:
- Sheet
- A3
- of
- Checked by:
- Approved by:
- VU PHAM
- Revision:
- Document No:
- V1.0.0
- Size:
- Date:
- 01/10/2024

### Library data of the parts
C75 C76 C85-C87 C89 C91-C95 C97 C99-C101 C104 C105 C107 C109-C134 C165-C168 = Capacitors: Value: 33pF
L5-L8 = L-SMD-1: partNo: 78477010; Manufacturer: Wurth Elektronik; Inductance: 1.0 μH; ComponentLink1Description: Manufacturer; ComponentLink1URL: http://www.we-online.de; Created by: Baojun Chen; Created Date: Nov.2015; ComponentLink2Description: Datasheet; ComponentLink2URL: http://katalog.we-online.de/pbs/datasheet/78477010.pdf
R8 R67-R74 R91 R93-R99 R139-R141 = Res SMD: as R1 on sheet POWERchDoc; Published: 08/06/2000; Publisher: Altium Hobart Technology Centre

## Sheet HEATER.SchDoc: HEATER
size 420 x 297 mm; SheetNumber: 7; SheetTotal: 11
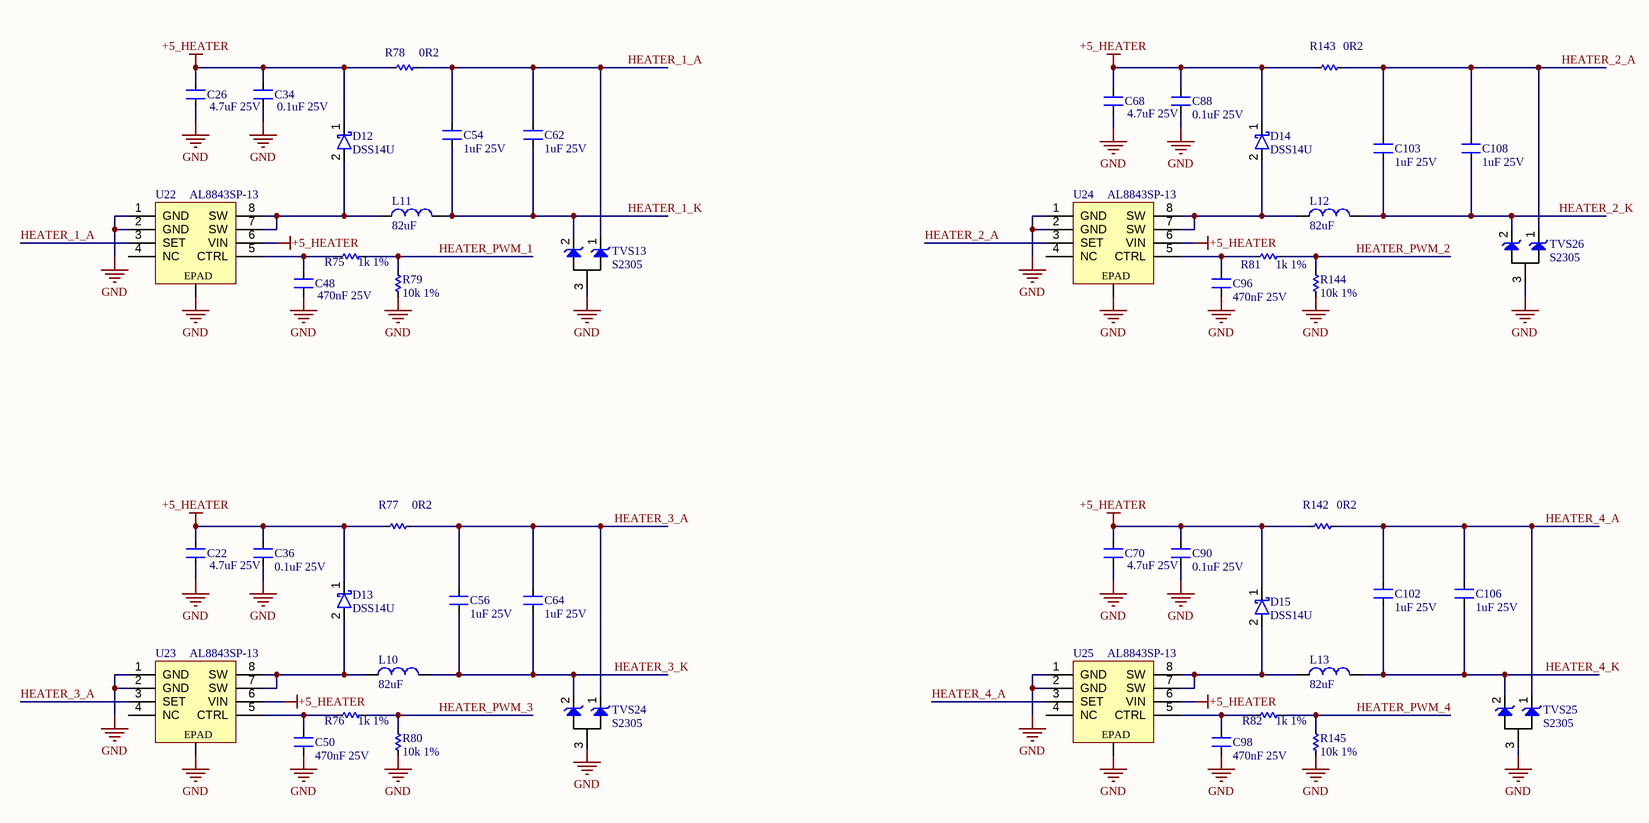
[diagram p6: HEATER.SchDoc]

### Parts
C22  4.7uF 25V  [CN-SMD-0603]
C26  4.7uF 25V  [CN-SMD-0603]
C34  0.1uF 25V  [CN-SMD-0603]
C36  0.1uF 25V  [CN-SMD-0603]
C48  470nF 25V  [CN-SMD-0603]
C50  470nF 25V  [CN-SMD-0603]
C54  1uF 25V  [CN-SMD-0603]
C56  1uF 25V  [CN-SMD-0603]
C62  1uF 25V  [CN-SMD-0603]
C64  1uF 25V  [CN-SMD-0603]
C68  4.7uF 25V  [CN-SMD-0603]
C70  4.7uF 25V  [CN-SMD-0603]
C88  0.1uF 25V  [CN-SMD-0603]
C90  0.1uF 25V  [CN-SMD-0603]
C96  470nF 25V  [CN-SMD-0603]
C98  470nF 25V  [CN-SMD-0603]
C102  1uF 25V  [CN-SMD-0603]
C103  1uF 25V  [CN-SMD-0603]
C106  1uF 25V  [CN-SMD-0603]
C108  1uF 25V  [CN-SMD-0603]
D12  DSS14U  [sod-123]
D13  DSS14U  [sod-123]
D14  DSS14U  [sod-123]
D15  DSS14U  [sod-123]
L10  82uF  [L-SMD-M-4.8x4.8x2.8mm]
L11  82uF  [L-SMD-M-4.8x4.8x2.8mm]
L12  82uF  [L-SMD-M-4.8x4.8x2.8mm]
L13  82uF  [L-SMD-M-4.8x4.8x2.8mm]
R75  1k 1%  [RES-SMD-0603]
R76  1k 1%  [RES-SMD-0603]
R77  0R2  [RES-SMD-1206]
R78  0R2  [RES-SMD-1206]
R79  10k 1%  [RES-SMD-0603]
R80  10k 1%  [RES-SMD-0603]
R81  1k 1%  [RES-SMD-0603]
R82  1k 1%  [RES-SMD-0603]
R142  0R2  [RES-SMD-1206]
R143  0R2  [RES-SMD-1206]
R144  10k 1%  [RES-SMD-0603]
R145  10k 1%  [RES-SMD-0603]
TVS13  S2305  [sot23-12_3]
TVS24  S2305  [sot23-12_3]
TVS25  S2305  [sot23-12_3]
TVS26  S2305  [sot23-12_3]
U22  AL8843SP-13  [SO8_EPAD]
U23  AL8843SP-13  [SO8_EPAD]
U24  AL8843SP-13  [SO8_EPAD]
U25  AL8843SP-13  [SO8_EPAD]

### Nets
+5_HEATER: C22.2 C26.2 C34.2 C36.2 C68.2 C70.2 C88.2 C90.2 D12.1 D13.1 D14.1 D15.1 R77.2 R78.2 R142.2 R143.2 U22.6(VIN) U23.6(VIN) U24.6(VIN) U25.6(VIN)
GND: C22.1 C26.1 C34.1 C36.1 C48.1 C50.1 C68.1 C70.1 C88.1 C90.1 C96.1 C98.1 R79.1 R80.1 R144.1 R145.1 TVS13.3 TVS24.3 TVS25.3 TVS26.3 U22.1(GND) U22.2(GND) U22.EPAD U23.1(GND) U23.2(GND) U23.EPAD U24.1(GND) U24.2(GND) U24.EPAD U25.1(GND) U25.2(GND) U25.EPAD
HEATER_1_A: C54.2 C62.2 R78.1 TVS13.1 U22.3(SET)
HEATER_1_K: C54.1 C62.1 L11.2 TVS13.2
HEATER_2_A: C103.2 C108.2 R143.1 TVS26.1 U24.3(SET)
HEATER_2_K: C103.1 C108.1 L12.2 TVS26.2
HEATER_3_A: C56.2 C64.2 R77.1 TVS24.1 U23.3(SET)
HEATER_3_K: C56.1 C64.1 L10.2 TVS24.2
HEATER_4_A: C102.2 C106.2 R142.1 TVS25.1 U25.3(SET)
HEATER_4_K: C102.1 C106.1 L13.2 TVS25.2
HEATER_PWM_1: R75.2 R79.2
HEATER_PWM_2: R81.2 R144.2
HEATER_PWM_3: R76.2 R80.2
HEATER_PWM_4: R82.2 R145.2
NetC48_2: C48.2 R75.1 U22.5(CTRL)
NetC50_2: C50.2 R76.1 U23.5(CTRL)
NetC96_2: C96.2 R81.1 U24.5(CTRL)
NetC98_2: C98.2 R82.1 U25.5(CTRL)
NetD12_2: D12.2 L11.1 U22.7(SW) U22.8(SW)
NetD13_2: D13.2 L10.1 U23.7(SW) U23.8(SW)
NetD14_2: D14.2 L12.1 U24.7(SW) U24.8(SW)
NetD15_2: D15.2 L13.1 U25.7(SW) U25.8(SW)

Not connected (* = marked no-connect by the designer): U22 4(NC); U23 4(NC); U24 4(NC); U25 4(NC)

### Notes on the sheet
- Project:
- BEE-PC1
- Sub-system:
- NANORACK_EXP_CONTROLLER
- Design by:
- SANG HUYNH
- BAO BUI Q.
- Sheet title:
- Sheet
- A3
- of
- Checked by:
- Approved by:
- VU PHAM
- Revision:
- Document No:
- V1.0.0
- Size:
- Date:
- 01/10/2024

### Library data of the parts
C22 C26 C34 C36 C48 C50 C54 C56 C62 C64 C68 C70 C88 C90 C96 C98 C102 C103 C106 C108 = Capacitors: Value: 33pF
L10-L13 = L-SMD-1: FIXED IND 82UH 2.25A 160MOHM SMD / PN: 744770182; partNo: 78477010; Manufacturer: Wurth Elektronik; Inductance: 1.0 μH; ComponentLink1Description: Manufacturer; ComponentLink1URL: http://www.we-online.de; Created by: Baojun Chen; Created Date: Nov.2015; ComponentLink2Description: Datasheet; ComponentLink2URL: http://katalog.we-online.de/pbs/datasheet/78477010.pdf
R75 R76 R79-R82 R144 R145 = Res SMD: as R1 on sheet POWERchDoc; Published: 08/06/2000; Publisher: Altium Hobart Technology Centre
R77 R78 R142 R143 = Res-SMD: RES 0.1 OHM 1% 1W 1206 / PN: PE1206FRF470R1L; Manufacturer: Generic Components; Class: Passive; Published: 08/06/2000; Publisher: Altium Hobart Technology Centre
TVS13 TVS24-TVS26 = S2305: TVS DIODE 5VWM 10.8VC SOT23
U22-U25 = AL8843SP-13: IC LED DRIVER RGLTR PWM 3A 8SO

## Sheet NTC.SchDoc: NTC
size 420 x 297 mm; SheetNumber: 8; SheetTotal: 11
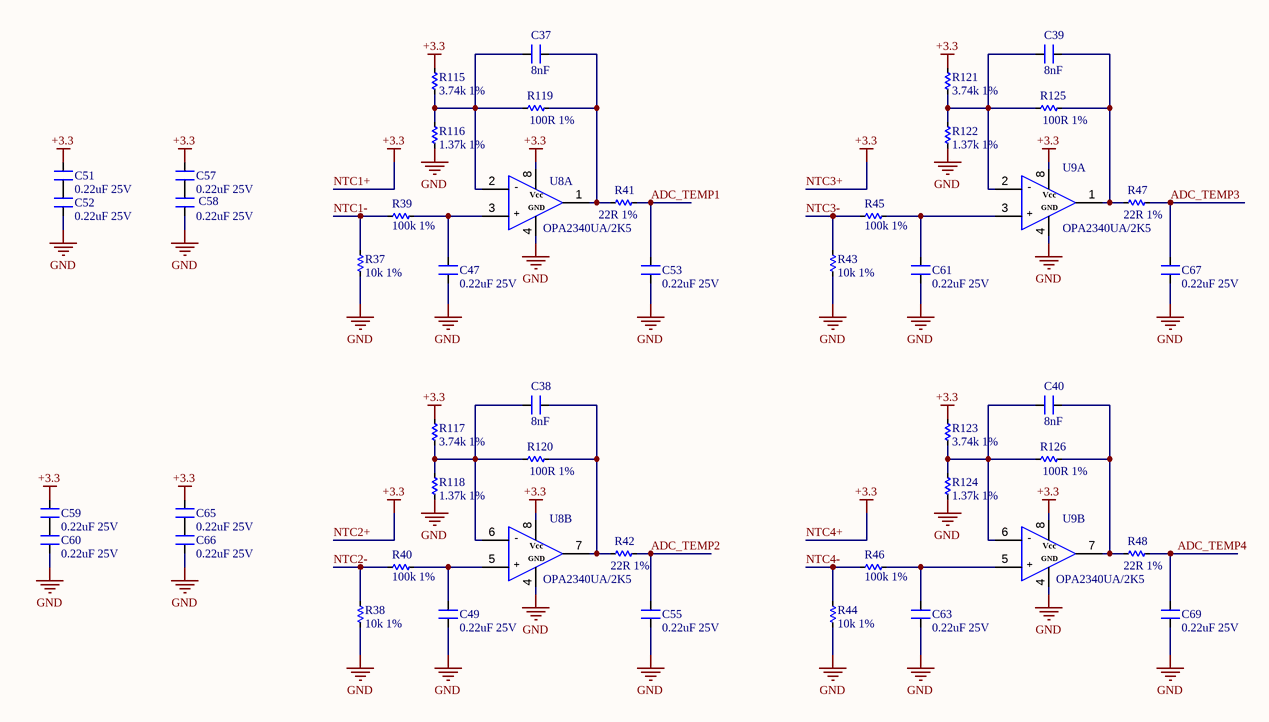
[diagram p7: NTC.SchDoc]

### Parts
C37  8nF  [CN-SMD-0603]
C38  8nF  [CN-SMD-0603]
C39  8nF  [CN-SMD-0603]
C40  8nF  [CN-SMD-0603]
C47  0.22uF 25V  [CN-SMD-0603]
C49  0.22uF 25V  [CN-SMD-0603]
C51  0.22uF 25V  [CN-SMD-0603]
C52  0.22uF 25V  [CN-SMD-0603]
C53  0.22uF 25V  [CN-SMD-0603]
C55  0.22uF 25V  [CN-SMD-0603]
C57  0.22uF 25V  [CN-SMD-0603]
C58  0.22uF 25V  [CN-SMD-0603]
C59  0.22uF 25V  [CN-SMD-0603]
C60  0.22uF 25V  [CN-SMD-0603]
C61  0.22uF 25V  [CN-SMD-0603]
C63  0.22uF 25V  [CN-SMD-0603]
C65  0.22uF 25V  [CN-SMD-0603]
C66  0.22uF 25V  [CN-SMD-0603]
C67  0.22uF 25V  [CN-SMD-0603]
C69  0.22uF 25V  [CN-SMD-0603]
R37  10k 1%  [RES-SMD-0603]
R38  10k 1%  [RES-SMD-0603]
R39  100k 1%  [RES-SMD-0603]
R40  100k 1%  [RES-SMD-0603]
R41  22R 1%  [RES-SMD-0603]
R42  22R 1%  [RES-SMD-0603]
R43  10k 1%  [RES-SMD-0603]
R44  10k 1%  [RES-SMD-0603]
R45  100k 1%  [RES-SMD-0603]
R46  100k 1%  [RES-SMD-0603]
R47  22R 1%  [RES-SMD-0603]
R48  22R 1%  [RES-SMD-0603]
R115  3.74k 1%  [RES-SMD-0603]
R116  1.37k 1%  [RES-SMD-0603]
R117  3.74k 1%  [RES-SMD-0603]
R118  1.37k 1%  [RES-SMD-0603]
R119  100R 1%  [RES-SMD-0603]
R120  100R 1%  [RES-SMD-0603]
R121  3.74k 1%  [RES-SMD-0603]
R122  1.37k 1%  [RES-SMD-0603]
R123  3.74k 1%  [RES-SMD-0603]
R124  1.37k 1%  [RES-SMD-0603]
R125  100R 1%  [RES-SMD-0603]
R126  100R 1%  [RES-SMD-0603]
U8  OPA2340UA/2K5  [SO8]  (parts A,B of 2)
U9  OPA2340UA/2K5  [SO8]  (parts A,B of 2)

### Nets
+3.3: C51.2 C57.2 C59.2 C65.2 R115.2 R117.2 R121.2 R123.2 U8.8 U9.8  [also labelled NTC1+, NTC2+, NTC3+, NTC4+]  [project net 3V3_EXP]
GND: C47.1 C49.1 C52.1 C53.1 C55.1 C58.1 C60.1 C61.1 C63.1 C66.1 C67.1 C69.1 R37.2 R38.2 R43.2 R44.2 R116.1 R118.1 R122.1 R124.1 U8.4 U9.4
ADC_TEMP1: C53.2 R41.2
ADC_TEMP2: C55.2 R42.2
ADC_TEMP3: C67.2 R47.2
ADC_TEMP4: C69.2 R48.2
NTC1-: R37.1 R39.1
NTC2-: R38.1 R40.1
NTC3-: R43.1 R45.1
NTC4-: R44.1 R46.1
NetC37_1: C37.1 R41.1 R119.2 U8.1
NetC37_2: C37.2 R115.1 R116.2 R119.1 U8.2
NetC38_1: C38.1 R42.1 R120.2 U8.7
NetC38_2: C38.2 R117.1 R118.2 R120.1 U8.6
NetC39_1: C39.1 R47.1 R125.2 U9.1
NetC39_2: C39.2 R121.1 R122.2 R125.1 U9.2
NetC40_1: C40.1 R48.1 R126.2 U9.7
NetC40_2: C40.2 R123.1 R124.2 R126.1 U9.6
NetC47_2: C47.2 R39.2 U8.3
NetC49_2: C49.2 R40.2 U8.5
NetC51_1: C51.1 C52.2
NetC57_1: C57.1 C58.2
NetC59_1: C59.1 C60.2
NetC61_2: C61.2 R45.2 U9.3
NetC63_2: C63.2 R46.2 U9.5
NetC65_1: C65.1 C66.2

### Notes on the sheet
- Project:
- BEE-PC1
- Sub-system:
- NANORACK_EXP_CONTROLLER
- Design by:
- SANG HUYNH
- BAO BUI Q.
- Sheet title:
- Sheet
- A3
- of
- Checked by:
- Approved by:
- VU PHAM
- Revision:
- Document No:
- V1.0.0
- Size:
- Date:
- 01/10/2024
- (in symbol OPA2340UA/2K5, part A) -; Vcc; GND; +
- (in symbol OPA2340UA/2K5, part B) -; Vcc; GND; +

### Library data of the parts
C37-C40 C47 C49 C51-C53 C55 C57-C61 C63 C65-C67 C69 = Capacitors: Value: 33pF
R37-R48 R115-R126 = Res SMD: as R1 on sheet POWERchDoc; Published: 08/06/2000; Publisher: Altium Hobart Technology Centre

## Sheet I2C_SENSOR.SchDoc: I2C_SENSOR
size 420 x 297 mm; SheetNumber: 9; SheetTotal: 11
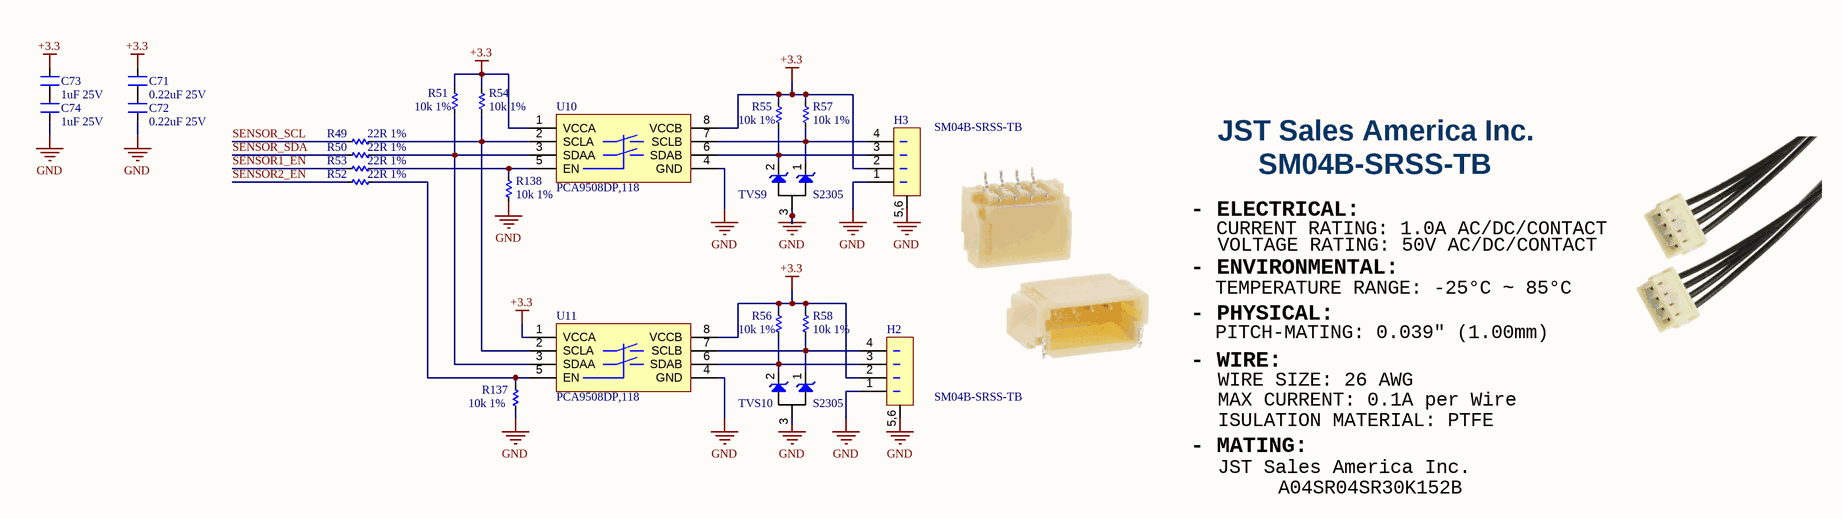
[diagram p8: I2C_SENSOR.SchDoc]

### Parts
C71  0.22uF 25V  [CN-SMD-0603]
C72  0.22uF 25V  [CN-SMD-0603]
C73  1uF 25V  [CN-SMD-0603]
C74  1uF 25V  [CN-SMD-0603]
H2  SM04B-SRSS-TB  [CONN_SM04B_JST]
H3  SM04B-SRSS-TB  [CONN_SM04B_JST]
R49  22R 1%  [RES-SMD-0603]
R50  22R 1%  [RES-SMD-0603]
R51  10k 1%  [RES-SMD-0603]
R52  22R 1%  [RES-SMD-0603]
R53  22R 1%  [RES-SMD-0603]
R54  10k 1%  [RES-SMD-0603]
R55  10k 1%  [RES-SMD-0603]
R56  10k 1%  [RES-SMD-0603]
R57  10k 1%  [RES-SMD-0603]
R58  10k 1%  [RES-SMD-0603]
R137  10k 1%  [RES-SMD-0603]
R138  10k 1%  [RES-SMD-0603]
TVS9  S2305  [sot23-12_3]
TVS10  S2305  [sot23-12_3]
U10  PCA9508DP,118  [TSOP8]
U11  PCA9508DP,118  [TSOP8]

### Nets
+3.3: C71.2 C73.2 H2.2 H3.2 R51.1 R54.1 R55.1 R56.1 R57.1 R58.1 U10.1(VCCA) U10.8(VCCB) U11.1(VCCA) U11.8(VCCB)  [project net 3V3_EXP]
GND: C72.1 C74.1 H2.1 H2.5,6 H3.1 H3.5,6 R137.2 R138.2 TVS9.3 TVS10.3 U10.4(GND) U11.4(GND)
SENSOR1_EN: R53.1
SENSOR2_EN: R52.1
SENSOR_SCL: R49.1
SENSOR_SDA: R50.1
NetC71_1: C71.1 C72.2
NetC73_1: C73.1 C74.2
NetH2_3: H2.3 R56.2 TVS10.2 U11.6(SDAB)
NetH2_4: H2.4 R58.2 TVS10.1 U11.7(SCLB)
NetH3_3: H3.3 R55.2 TVS9.2 U10.6(SDAB)
NetH3_4: H3.4 R57.2 TVS9.1 U10.7(SCLB)
NetR49_2: R49.2 R54.2 U10.2(SCLA) U11.2(SCLA)
NetR50_2: R50.2 R51.2 U10.3(SDAA) U11.3(SDAA)
NetR52_2: R52.2 R137.1 U11.5(EN)
NetR53_2: R53.2 R138.1 U10.5(EN)

### Notes on the sheet
- JST Sales America Inc.
- SM04B-SRSS-TB
- - ELECTRICAL:
- CURRENT RATING: 1.0A AC/DC/CONTACT
- VOLTAGE RATING: 50V AC/DC/CONTACT
- - ENVIRONMENTAL:
- - PHYSICAL:
- TEMPERATURE RANGE: -25°C ~ 85°C
- - WIRE:
- PITCH-MATING: 0.039" (1.00mm)
- WIRE SIZE: 26 AWG
- - MATING:
- MAX CURRENT: 0.1A per Wire
- ISULATION MATERIAL: PTFE
- A04SR04SR30K152B
- Project:
- BEE-PC1
- Sub-system:
- NANORACK_EXP_CONTROLLER
- Design by:
- SANG HUYNH
- BAO BUI Q.
- Sheet title:
- Sheet
- A3
- of
- Checked by:
- Approved by:
- VU PHAM
- Revision:
- Document No:
- V1.0.0
- Size:
- Date:
- 01/10/2024

### Library data of the parts
C71-C74 = Capacitors: Value: 33pF
H2 H3 = SM04B-SRSS-TBLFSN
R49-R58 R137 R138 = Res SMD: as R1 on sheet POWERchDoc; Published: 08/06/2000; Publisher: Altium Hobart Technology Centre
TVS9 TVS10 = S2305: TVS DIODE 5VWM 10.8VC SOT23

## Sheet LED.SchDoc: LED
size 420 x 297 mm; SheetNumber: 10; SheetTotal: 11
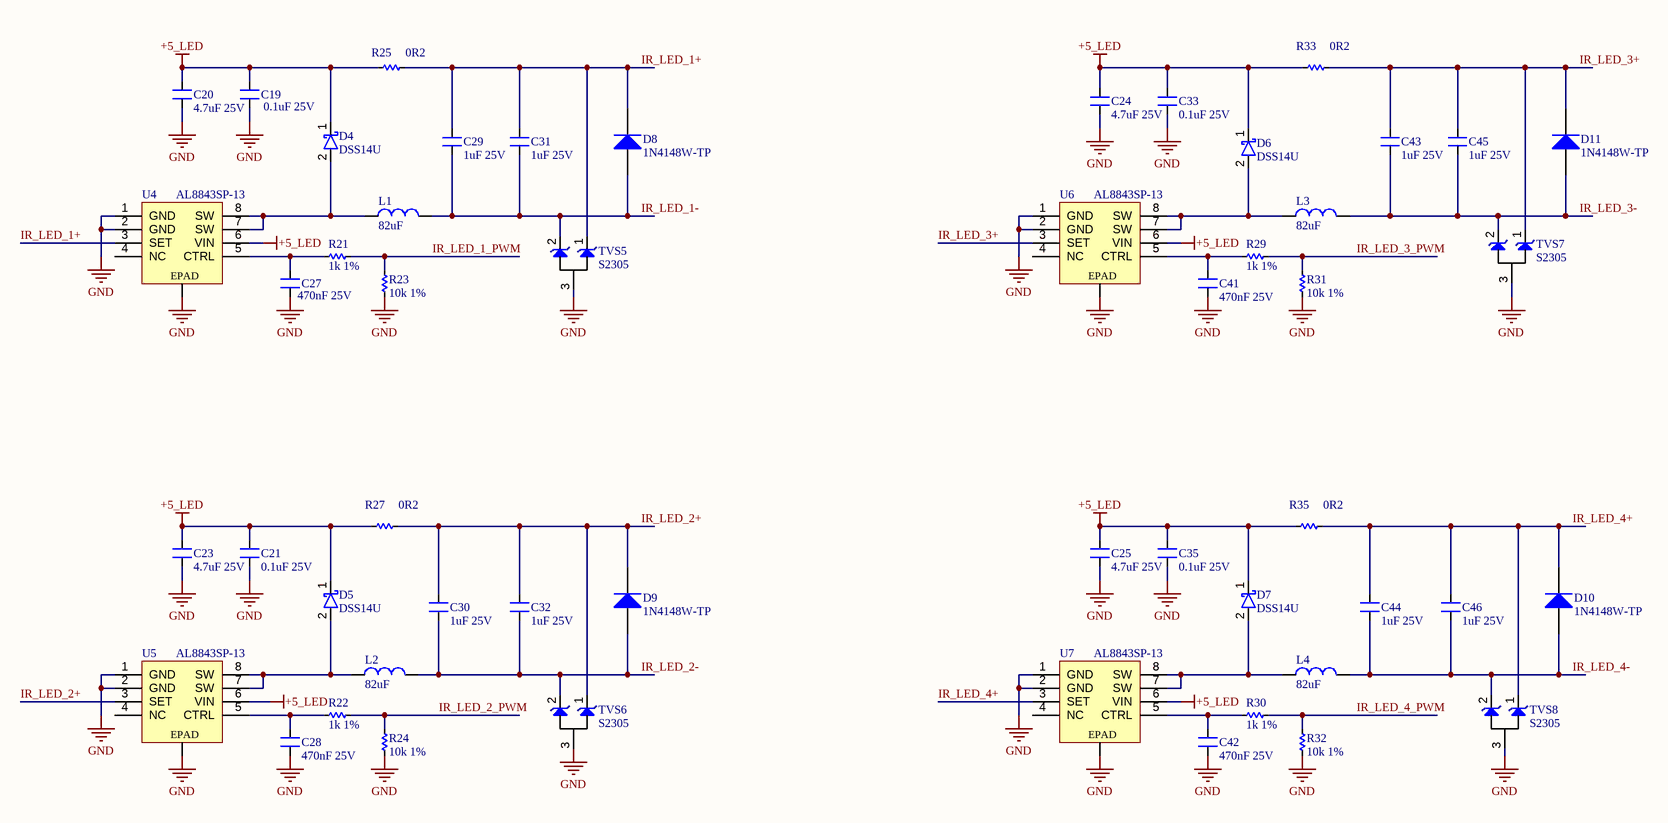
[diagram p9: LED.SchDoc]

### Parts
C19  0.1uF 25V  [CN-SMD-0603]
C20  4.7uF 25V  [CN-SMD-0603]
C21  0.1uF 25V  [CN-SMD-0603]
C23  4.7uF 25V  [CN-SMD-0603]
C24  4.7uF 25V  [CN-SMD-0603]
C25  4.7uF 25V  [CN-SMD-0603]
C27  470nF 25V  [CN-SMD-0603]
C28  470nF 25V  [CN-SMD-0603]
C29  1uF 25V  [CN-SMD-0603]
C30  1uF 25V  [CN-SMD-0603]
C31  1uF 25V  [CN-SMD-0603]
C32  1uF 25V  [CN-SMD-0603]
C33  0.1uF 25V  [CN-SMD-0603]
C35  0.1uF 25V  [CN-SMD-0603]
C41  470nF 25V  [CN-SMD-0603]
C42  470nF 25V  [CN-SMD-0603]
C43  1uF 25V  [CN-SMD-0603]
C44  1uF 25V  [CN-SMD-0603]
C45  1uF 25V  [CN-SMD-0603]
C46  1uF 25V  [CN-SMD-0603]
D4  DSS14U  [sod-123]
D5  DSS14U  [sod-123]
D6  DSS14U  [sod-123]
D7  DSS14U  [sod-123]
D8  1N4148W-TP  [SOD-123]
D9  1N4148W-TP  [SOD-123]
D10  1N4148W-TP  [SOD-123]
D11  1N4148W-TP  [SOD-123]
L1  82uF  [L-SMD-M-4.8x4.8x2.8mm]
L2  82uF  [L-SMD-M-4.8x4.8x2.8mm]
L3  82uF  [L-SMD-M-4.8x4.8x2.8mm]
L4  82uF  [L-SMD-M-4.8x4.8x2.8mm]
R21  1k 1%  [RES-SMD-0603]
R22  1k 1%  [RES-SMD-0603]
R23  10k 1%  [RES-SMD-0603]
R24  10k 1%  [RES-SMD-0603]
R25  0R2  [RES-SMD-1206]
R27  0R2  [RES-SMD-1206]
R29  1k 1%  [RES-SMD-0603]
R30  1k 1%  [RES-SMD-0603]
R31  10k 1%  [RES-SMD-0603]
R32  10k 1%  [RES-SMD-0603]
R33  0R2  [RES-SMD-1206]
R35  0R2  [RES-SMD-1206]
TVS5  S2305  [sot23-12_3]
TVS6  S2305  [sot23-12_3]
TVS7  S2305  [sot23-12_3]
TVS8  S2305  [sot23-12_3]
U4  AL8843SP-13  [SO8_EPAD]
U5  AL8843SP-13  [SO8_EPAD]
U6  AL8843SP-13  [SO8_EPAD]
U7  AL8843SP-13  [SO8_EPAD]

### Nets
+5_LED: C19.2 C20.2 C21.2 C23.2 C24.2 C25.2 C33.2 C35.2 D4.1 D5.1 D6.1 D7.1 R25.2 R27.2 R33.2 R35.2 U4.6(VIN) U5.6(VIN) U6.6(VIN) U7.6(VIN)
GND: C19.1 C20.1 C21.1 C23.1 C24.1 C25.1 C27.1 C28.1 C33.1 C35.1 C41.1 C42.1 R23.1 R24.1 R31.1 R32.1 TVS5.3 TVS6.3 TVS7.3 TVS8.3 U4.1(GND) U4.2(GND) U4.EPAD U5.1(GND) U5.2(GND) U5.EPAD U6.1(GND) U6.2(GND) U6.EPAD U7.1(GND) U7.2(GND) U7.EPAD
IR_LED_1+: C29.2 C31.2 D8.2(K) R25.1 TVS5.1 U4.3(SET)
IR_LED_1-: C29.1 C31.1 D8.1(A) L1.2 TVS5.2
IR_LED_1_PWM: R21.2 R23.2
IR_LED_2+: C30.2 C32.2 D9.2(K) R27.1 TVS6.1 U5.3(SET)
IR_LED_2-: C30.1 C32.1 D9.1(A) L2.2 TVS6.2
IR_LED_2_PWM: R22.2 R24.2
IR_LED_3+: C43.2 C45.2 D11.2(K) R33.1 TVS7.1 U6.3(SET)
IR_LED_3-: C43.1 C45.1 D11.1(A) L3.2 TVS7.2
IR_LED_3_PWM: R29.2 R31.2
IR_LED_4+: C44.2 C46.2 D10.2(K) R35.1 TVS8.1 U7.3(SET)
IR_LED_4-: C44.1 C46.1 D10.1(A) L4.2 TVS8.2
IR_LED_4_PWM: R30.2 R32.2
NetC27_2: C27.2 R21.1 U4.5(CTRL)
NetC28_2: C28.2 R22.1 U5.5(CTRL)
NetC41_2: C41.2 R29.1 U6.5(CTRL)
NetC42_2: C42.2 R30.1 U7.5(CTRL)
NetD4_2: D4.2 L1.1 U4.7(SW) U4.8(SW)
NetD5_2: D5.2 L2.1 U5.7(SW) U5.8(SW)
NetD6_2: D6.2 L3.1 U6.7(SW) U6.8(SW)
NetD7_2: D7.2 L4.1 U7.7(SW) U7.8(SW)

Not connected (* = marked no-connect by the designer): U4 4(NC); U5 4(NC); U6 4(NC); U7 4(NC)

### Notes on the sheet
- Project:
- BEE-PC1
- Sub-system:
- NANORACK_EXP_CONTROLLER
- Design by:
- SANG HUYNH
- BAO BUI Q.
- Sheet title:
- Sheet
- A3
- of
- Checked by:
- Approved by:
- VU PHAM
- Revision:
- Document No:
- V1.0.0
- Size:
- Date:
- 01/10/2024

### Library data of the parts
C19-C21 C23-C25 C27-C33 C35 C41-C46 = Capacitors: Value: 33pF
D8-D11 = 1N4148-W-7: DIODE GEN PURP 100V 300MA SOD123; MPN: 1N4148W-7-F; MFR: Diodes Incorporated; Solder: SMT; Value: 100V/300MA
L1-L4 = L-SMD-1: as L10 on sheet HEATER; ComponentLink1Description: Manufacturer; ComponentLink1URL: http://www.we-online.de; Created by: Baojun Chen; Created Date: Nov.2015; ComponentLink2Description: Datasheet; ComponentLink2URL: http://katalog.we-online.de/pbs/datasheet/78477010.pdf
R21-R24 R29-R32 = Res SMD: as R1 on sheet POWERchDoc; Published: 08/06/2000; Publisher: Altium Hobart Technology Centre
R25 R27 R33 R35 = Res-SMD: as R77 on sheet HEATER; Published: 08/06/2000; Publisher: Altium Hobart Technology Centre
TVS5-TVS8 = S2305: TVS DIODE 5VWM 10.8VC SOT23
U4-U7 = AL8843SP-13: IC LED DRIVER RGLTR PWM 3A 8SO

## Sheet MCU.SchDoc: MCU
size 420 x 297 mm; SheetNumber: 11; SheetTotal: 11
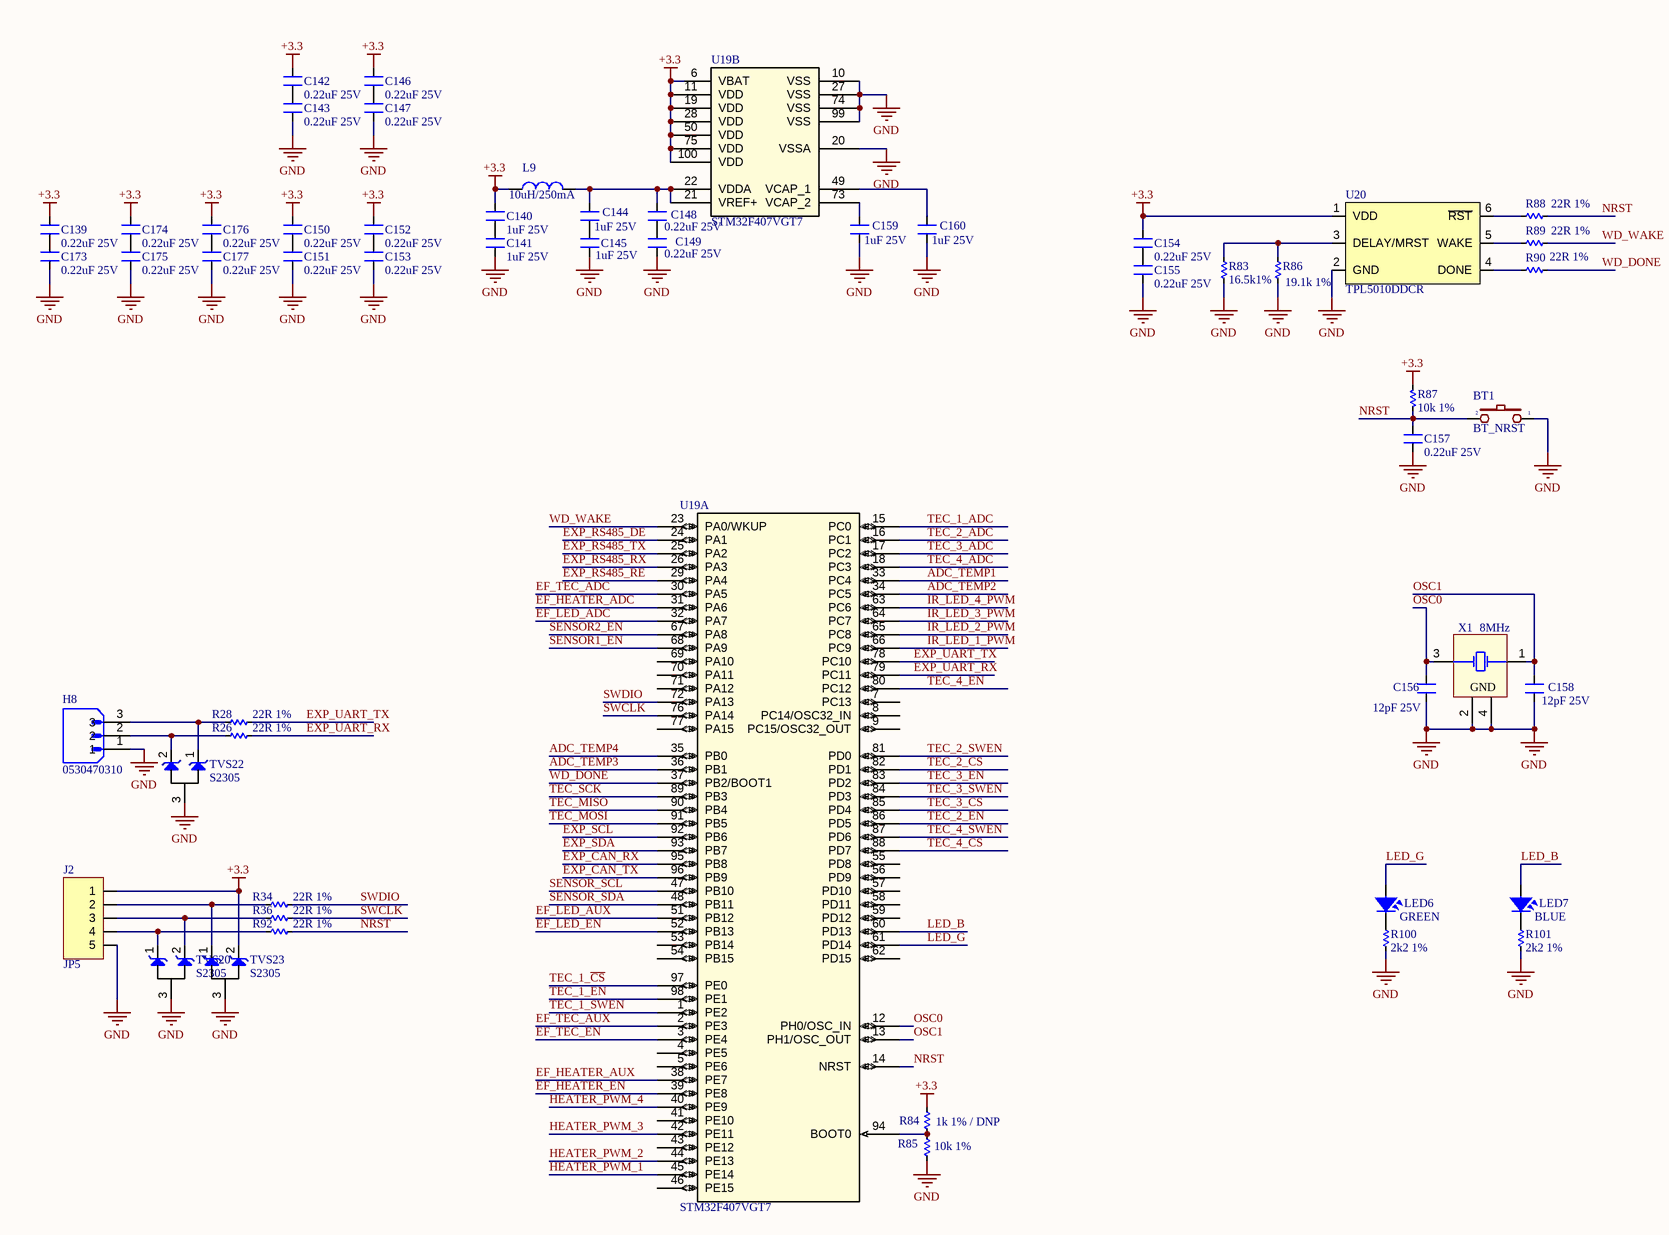
[diagram p10: MCU.SchDoc]

### Parts
BT1  BT_NRST  [SW1-SMD]
C139  0.22uF 25V  [CN-SMD-0603]
C140  1uF 25V  [CN-SMD-0603]
C141  1uF 25V  [CN-SMD-0603]
C142  0.22uF 25V  [CN-SMD-0603]
C143  0.22uF 25V  [CN-SMD-0603]
C144  1uF 25V  [CN-SMD-0603]
C145  1uF 25V  [CN-SMD-0603]
C146  0.22uF 25V  [CN-SMD-0603]
C147  0.22uF 25V  [CN-SMD-0603]
C148  0.22uF 25V  [CN-SMD-0603]
C149  0.22uF 25V  [CN-SMD-0603]
C150  0.22uF 25V  [CN-SMD-0603]
C151  0.22uF 25V  [CN-SMD-0603]
C152  0.22uF 25V  [CN-SMD-0603]
C153  0.22uF 25V  [CN-SMD-0603]
C154  0.22uF 25V  [CN-SMD-0603]
C155  0.22uF 25V  [CN-SMD-0603]
C156  12pF 25V  [CN-SMD-0603]
C157  0.22uF 25V  [CN-SMD-0603]
C158  12pF 25V  [CN-SMD-0603]
C159  1uF 25V  [CN-SMD-0603]
C160  1uF 25V  [CN-SMD-0603]
C173  0.22uF 25V  [CN-SMD-0603]
C174  0.22uF 25V  [CN-SMD-0603]
C175  0.22uF 25V  [CN-SMD-0603]
C176  0.22uF 25V  [CN-SMD-0603]
C177  0.22uF 25V  [CN-SMD-0603]
H8  0530470310  [0530470310]
J2  JP5  [JP5-D1T]
L9  10uH/250mA  [L-SMD-0603]
LED6  GREEN  [LED_0603_RED]
LED7  BLUE  [LED_0603_RED]
R26  22R 1%  [RES-SMD-0603]
R28  22R 1%  [RES-SMD-0603]
R34  22R 1%  [RES-SMD-0603]
R36  22R 1%  [RES-SMD-0603]
R83  16.5k1%  [RES-SMD-0603]
R84  1k 1% / DNP  [RES-SMD-0603]
R85  10k 1%  [RES-SMD-0603]
R86  19.1k 1%  [RES-SMD-0603]
R87  10k 1%  [RES-SMD-0603]
R88  22R 1%  [RES-SMD-0603]
R89  22R 1%  [RES-SMD-0603]
R90  22R 1%  [RES-SMD-0603]
R92  22R 1%  [RES-SMD-0603]
R100  2k2 1%  [RES-SMD-0603]
R101  2k2 1%  [RES-SMD-0603]
TVS20  S2305  [sot23-12_3]
TVS22  S2305  [sot23-12_3]
TVS23  S2305  [sot23-12_3]
U19  STM32F407VGT7  [LQFP-100]  (parts A,B of 2)
U20  TPL5010DDCR  [SOT23-6-123_456]
X1  8MHz  [XT4-16.000MHz-4_V]

### Nets
+3.3: C139.2 C140.2 C142.2 C146.2 C150.2 C152.2 C154.2 C174.2 C176.2 J2.1 L9.1 R84.1 R87.1 TVS23.2 U19.6(VBAT) U19.11(VDD) U19.19(VDD) U19.28(VDD) U19.50(VDD) U19.75(VDD) U19.100(VDD) U20.1(VDD)  [project net 3V3_EXP]
GND: BT1.1 C141.1 C143.1 C145.1 C147.1 C149.1 C151.1 C153.1 C155.1 C156.2 C157.1 C158.1 C159.1 C160.1 C173.1 C175.1 C177.1 H8.1 J2.5 R83.1 R85.2 R86.1 R100.2 R101.2 TVS20.3 TVS22.3 TVS23.3 U19.10(VSS) U19.20(VSSA) U19.27(VSS) U19.74(VSS) U19.99(VSS) U20.2(GND) X1.2(GND) X1.4(GND)
ADC_TEMP1: U19.33(PC4)
ADC_TEMP2: U19.34(PC5)
ADC_TEMP3: U19.36(PB1)
ADC_TEMP4: U19.35(PB0)
EF_HEATER_ADC: U19.31(PA6)
EF_HEATER_AUX: U19.38(PE7)
EF_HEATER_EN: U19.39(PE8)
EF_LED_ADC: U19.32(PA7)
EF_LED_AUX: U19.51(PB12)
EF_LED_EN: U19.52(PB13)
EF_TEC_ADC: U19.30(PA5)
EF_TEC_AUX: U19.2(PE3)
EF_TEC_EN: U19.3(PE4)
EXP_CAN_RX: U19.95(PB8)
EXP_CAN_TX: U19.96(PB9)
EXP_RS485_DE: U19.24(PA1)
EXP_RS485_~{RE}: U19.29(PA4)
EXP_RS485_RX: U19.26(PA3)
EXP_RS485_TX: U19.25(PA2)
EXP_SCL: U19.92(PB6)
EXP_SDA: U19.93(PB7)
EXP_UART_RX: R26.1 U19.79(PC11)
EXP_UART_TX: R28.1 U19.78(PC10)
HEATER_PWM_1: U19.45(PE14)
HEATER_PWM_2: U19.44(PE13)
HEATER_PWM_3: U19.42(PE11)
HEATER_PWM_4: U19.40(PE9)
IR_LED_1_PWM: U19.66(PC9)
IR_LED_2_PWM: U19.65(PC8)
IR_LED_3_PWM: U19.64(PC7)
IR_LED_4_PWM: U19.63(PC6)
LED_B: LED7.1 U19.60(PD13)
LED_G: LED6.1 U19.61(PD14)
NRST: BT1.2 C157.2 R87.2 R88.2 R92.1 U19.14(NRST)
OSC0: C156.1 U19.12(PH0/OSC_IN) X1.3(XTAL)
OSC1: C158.2 U19.13(PH1/OSC_OUT) X1.1(XTAL)
SENSOR1_EN: U19.68(PA9)
SENSOR2_EN: U19.67(PA8)
SENSOR_SCL: U19.47(PB10)
SENSOR_SDA: U19.48(PB11)
SWCLK: R36.1 U19.76(PA14)
SWDIO: R34.1 U19.72(PA13)
TEC_1_ADC: U19.15(PC0)
TEC_1_~{CS}: U19.97(PE0)
TEC_1_EN: U19.98(PE1)
TEC_1_SWEN: U19.1(PE2)
TEC_2_ADC: U19.16(PC1)
TEC_2_~{CS}: U19.82(PD1)
TEC_2_EN: U19.86(PD5)
TEC_2_SWEN: U19.81(PD0)
TEC_3_ADC: U19.17(PC2)
TEC_3_~{CS}: U19.85(PD4)
TEC_3_EN: U19.83(PD2)
TEC_3_SWEN: U19.84(PD3)
TEC_4_ADC: U19.18(PC3)
TEC_4_~{CS}: U19.88(PD7)
TEC_4_EN: U19.80(PC12)
TEC_4_SWEN: U19.87(PD6)
TEC_MISO: U19.90(PB4)
TEC_MOSI: U19.91(PB5)
TEC_SCK: U19.89(PB3)
WD_DONE: R90.2 U19.37(PB2/BOOT1)
WD_WAKE: R89.2 U19.23(PA0/WKUP)
NetC139_1: C139.1 C173.2
NetC140_1: C140.1 C141.2
NetC142_1: C142.1 C143.2
NetC144_1: C144.1 C145.2
NetC144_2: C144.2 C148.2 L9.2 U19.21(VREF+) U19.22(VDDA)
NetC146_1: C146.1 C147.2
NetC148_1: C148.1 C149.2
NetC150_1: C150.1 C151.2
NetC152_1: C152.1 C153.2
NetC154_1: C154.1 C155.2
NetC159_2: C159.2 U19.73(VCAP_2)
NetC160_2: C160.2 U19.49(VCAP_1)
NetC174_1: C174.1 C175.2
NetC176_1: C176.1 C177.2
NetH8_2: H8.2 R26.2 TVS22.2
NetH8_3: H8.3 R28.2 TVS22.1
NetJ2_2: J2.2 R34.2 TVS23.1
NetJ2_3: J2.3 R36.2 TVS20.2
NetJ2_4: J2.4 R92.2 TVS20.1
NetLED6_2: LED6.2 R100.1
NetLED7_2: LED7.2 R101.1
NetR83_2: R83.2 R86.2 U20.3(DELAY/MRST)
NetR84_2: R84.2 R85.1 U19.94(BOOT0)
NetR88_1: R88.1 U20.6(~{RST})
NetR89_1: R89.1 U20.5(WAKE)
NetR90_1: R90.1 U20.4(DONE)

Not connected (* = marked no-connect by the designer): U19 4(PE5) 5(PE6) 7(PC13) 8(PC14/OSC32_IN) 9(PC15/OSC32_OUT) 41(PE10) 43(PE12) 46(PE15) 53(PB14) 54(PB15) 55(PD8) 56(PD9) 57(PD10) 58(PD11) 59(PD12) 62(PD15) 69(PA10) 70(PA11) 71(PA12) 77(PA15)

### Notes on the sheet
- Project:
- BEE-PC1
- Sub-system:
- NANORACK_EXP_CONTROLLER
- Design by:
- SANG HUYNH
- BAO BUI Q.
- Sheet title:
- Sheet
- A3
- of
- Checked by:
- Approved by:
- VU PHAM
- Revision:
- Document No:
- V1.0.0
- Size:
- Date:
- 01/10/2024

### Library data of the parts
BT1 = SW2: Switch button 2 pin; Value: SW chip 2 pin
C139-C160 C173-C177 = Capacitors: Value: 33pF
H8 = 0530470310: CONN HEADER VERT 3POS 1.25MM
J2 = JP5: WR-PHD 2.54 mm Angled Socket Header; Manufacturer: W¨¹rth Elektronik eiSos GmbH; partNo: 613005143121; ComponentLink1 Description: Manufacturer; ComponentLink2 Description: Datasheet; NoPins: 05; Created Date: 29 March 2013; ComponentLink1URL: http://www.we-online.com; ComponentLink2URL: http://katalog.we-online.de/em/datasheet/6130xx143121.pdf; Created by: Karrer Zheng
L9 = L-SMD-1: as L5 on sheet TECS_DRIVER; ComponentLink1Description: Manufacturer; ComponentLink1URL: http://www.we-online.de; Created by: Baojun Chen; Created Date: Nov.2015; ComponentLink2Description: Datasheet; ComponentLink2URL: http://katalog.we-online.de/pbs/datasheet/78477010.pdf
LED6 LED7 = LED SMD: Value: LED 3 - 5 ly 2 Colour
R26 R28 R34 R36 R83-R90 R92 R100 R101 = Res SMD: as R1 on sheet POWERchDoc; Published: 08/06/2000; Publisher: Altium Hobart Technology Centre
TVS20 TVS22 TVS23 = S2305: TVS DIODE 5VWM 10.8VC SOT23
U19 = STM32F407VGT7: ARM® Cortex®-M4 STM32F4 Microcontroller IC 32-Bit Single-Core 168MHz 1MB (1M x 8) FLASH 100-LQFP (14x14)
U20 = TPL5010DDCR: IC OSC PROG TIMER TSOT23-6
X1 = XT4: Crystal, 8 MHz, -30 to 85 degC, 3.2 x 2.5 x 0.9 mm SMD; Value: 4Mhz

## Nets that join several sheets
3V3_EXP: HEADERSchDoc (H1.3 H1.7 H1.11 H1.15), POWERchDoc (5 pins), ISO_COMMUNICATION (11 pins), TECS_DRIVER (8 pins), NTC (10 pins), I2C_SENSOR (14 pins), MCU (22 pins)
+5: HEADERSchDoc (5 pins), POWERchDoc (32 pins)
+5_HEATER: POWERchDoc (6 pins), HEATER (20 pins)
+5_LED: POWERchDoc (6 pins), LED (20 pins)
+5_TEC: POWERchDoc (6 pins), TECS_DRIVER (20 pins)
GND: HEADERSchDoc (5 pins), POWERchDoc (49 pins), ISO_COMMUNICATION (7 pins), TECS_DRIVER (52 pins), HEATER (32 pins), NTC (22 pins), I2C_SENSOR (12 pins), LED (32 pins), MCU (35 pins)
GND_BUS: HEADERSchDoc (18 pins), ISO_COMMUNICATION (6 pins)
VBUS: HEADERSchDoc (H4.11 H5.3 H7.A4 H7.A5), ISO_COMMUNICATION (8 pins)
ADC_TEMP1: NTC (C53.2 R41.2), MCU (U19.33)
ADC_TEMP2: NTC (C55.2 R42.2), MCU (U19.34)
ADC_TEMP3: NTC (C67.2 R47.2), MCU (U19.36)
ADC_TEMP4: NTC (C69.2 R48.2), MCU (U19.35)
EF_HEATER_ADC: POWERchDoc (R12.1 U2.9), MCU (U19.31)
EF_HEATER_AUX: POWERchDoc (R113.2), MCU (U19.38)
EF_HEATER_EN: POWERchDoc (R102.1), MCU (U19.39)
EF_LED_ADC: POWERchDoc (R13.1 U3.9), MCU (U19.32)
EF_LED_AUX: POWERchDoc (R114.2), MCU (U19.51)
EF_LED_EN: POWERchDoc (R5.1), MCU (U19.52)
EF_TEC_ADC: POWERchDoc (R11.1 U1.9), MCU (U19.30)
EF_TEC_AUX: POWERchDoc (R112.2), MCU (U19.2)
EF_TEC_EN: POWERchDoc (R2.1), MCU (U19.3)
EXP_CAN_RX: ISO_COMMUNICATION (R129.2), MCU (U19.95)
EXP_CAN_TX: ISO_COMMUNICATION (R128.2), MCU (U19.96)
EXP_RS485_DE: ISO_COMMUNICATION (R132.2), MCU (U19.24)
EXP_RS485_~{RE}: ISO_COMMUNICATION (R131.2), MCU (U19.29)
EXP_RS485_RX: ISO_COMMUNICATION (R136.2), MCU (U19.26)
EXP_RS485_TX: ISO_COMMUNICATION (R135.2), MCU (U19.25)
EXP_SCL: ISO_COMMUNICATION (R134.2), MCU (U19.92)
EXP_SDA: ISO_COMMUNICATION (R133.2), MCU (U19.93)
HEATER_1_A: HEADERSchDoc (H6.8), HEATER (5 pins)
HEATER_1_K: HEADERSchDoc (H6.7), HEATER (C54.1 C62.1 L11.2 TVS13.2)
HEATER_2_A: HEADERSchDoc (H6.6), HEATER (5 pins)
HEATER_2_K: HEADERSchDoc (H6.5), HEATER (C103.1 C108.1 L12.2 TVS26.2)
HEATER_3_A: HEADERSchDoc (H6.4), HEATER (5 pins)
HEATER_3_K: HEADERSchDoc (H6.3), HEATER (C56.1 C64.1 L10.2 TVS24.2)
HEATER_4_A: HEADERSchDoc (H6.2), HEATER (5 pins)
HEATER_4_K: HEADERSchDoc (H6.1), HEATER (C102.1 C106.1 L13.2 TVS25.2)
HEATER_PWM_1: HEATER (R75.2 R79.2), MCU (U19.45)
HEATER_PWM_2: HEATER (R81.2 R144.2), MCU (U19.44)
HEATER_PWM_3: HEATER (R76.2 R80.2), MCU (U19.42)
HEATER_PWM_4: HEATER (R82.2 R145.2), MCU (U19.40)
IR_LED_1+: HEADERSchDoc (H6.16), LED (6 pins)
IR_LED_1-: HEADERSchDoc (H6.15), LED (5 pins)
IR_LED_1_PWM: LED (R21.2 R23.2), MCU (U19.66)
IR_LED_2+: HEADERSchDoc (H6.14), LED (6 pins)
IR_LED_2-: HEADERSchDoc (H6.13), LED (5 pins)
IR_LED_2_PWM: LED (R22.2 R24.2), MCU (U19.65)
IR_LED_3+: HEADERSchDoc (H6.12), LED (6 pins)
IR_LED_3-: HEADERSchDoc (H6.11), LED (5 pins)
IR_LED_3_PWM: LED (R29.2 R31.2), MCU (U19.64)
IR_LED_4+: HEADERSchDoc (H6.10), LED (6 pins)
IR_LED_4-: HEADERSchDoc (H6.9), LED (5 pins)
IR_LED_4_PWM: LED (R30.2 R32.2), MCU (U19.63)
ISO_CANH: HEADERSchDoc (H4.6 TVS16.2), ISO_COMMUNICATION (U14.7)
ISO_CANL: HEADERSchDoc (H4.4 TVS16.1), ISO_COMMUNICATION (U14.6)
ISO_RS485_R+: HEADERSchDoc (H4.33 TVS19.2), ISO_COMMUNICATION (R61.2 U13.14)
ISO_RS485_R-: HEADERSchDoc (H4.31 TVS19.1), ISO_COMMUNICATION (R61.1 U13.13)
ISO_RS485_T+: HEADERSchDoc (H4.34 TVS4.2), ISO_COMMUNICATION (R65.1 U13.11)
ISO_RS485_T-: HEADERSchDoc (H4.32 TVS4.1), ISO_COMMUNICATION (R65.2 U13.12)
ISO_SCL0: HEADERSchDoc (H4.8 TVS18.1), ISO_COMMUNICATION (R59.1 U12.3)
ISO_SDA0: HEADERSchDoc (H4.10 TVS18.2), ISO_COMMUNICATION (R60.1 U12.2)
NTC1-: HEADERSchDoc (H1.13), NTC (R37.1 R39.1)
NTC2-: HEADERSchDoc (H1.9), NTC (R38.1 R40.1)
NTC3-: HEADERSchDoc (H1.5), NTC (R43.1 R45.1)
NTC4-: HEADERSchDoc (H1.1), NTC (R44.1 R46.1)
SENSOR1_EN: I2C_SENSOR (R53.1), MCU (U19.68)
SENSOR2_EN: I2C_SENSOR (R52.1), MCU (U19.67)
SENSOR_SCL: I2C_SENSOR (R49.1), MCU (U19.47)
SENSOR_SDA: I2C_SENSOR (R50.1), MCU (U19.48)
TEC_1_A: HEADERSchDoc (H1.16), TECS_DRIVER (C105.2 C112.2 C122.2 U15.8,9)
TEC_1_ADC: TECS_DRIVER (R8.2), MCU (U19.15)
TEC_1_B: HEADERSchDoc (H1.14), TECS_DRIVER (C109.2 C122.1 L5.2 U15.12)
TEC_1_~{CS}: TECS_DRIVER (U15.15), MCU (U19.97)
TEC_1_EN: TECS_DRIVER (R69.1), MCU (U19.98)
TEC_1_SWEN: TECS_DRIVER (R93.1), MCU (U19.1)
TEC_2_A: HEADERSchDoc (H1.12), TECS_DRIVER (C125.2 C129.2 C130.2 U17.8,9)
TEC_2_ADC: TECS_DRIVER (R140.2), MCU (U19.16)
TEC_2_B: HEADERSchDoc (H1.10), TECS_DRIVER (C130.1 C133.2 L7.2 U17.12)
TEC_2_~{CS}: TECS_DRIVER (U17.15), MCU (U19.82)
TEC_2_EN: TECS_DRIVER (R73.1), MCU (U19.86)
TEC_2_SWEN: TECS_DRIVER (R96.1), MCU (U19.81)
TEC_3_A: HEADERSchDoc (H1.8), TECS_DRIVER (C107.2 C114.2 C120.2 U16.8,9)
TEC_3_ADC: TECS_DRIVER (R139.2), MCU (U19.17)
TEC_3_B: HEADERSchDoc (H1.6), TECS_DRIVER (C110.2 C120.1 L6.2 U16.12)
TEC_3_~{CS}: TECS_DRIVER (U16.15), MCU (U19.85)
TEC_3_EN: TECS_DRIVER (R70.1), MCU (U19.83)
TEC_3_SWEN: TECS_DRIVER (R94.1), MCU (U19.84)
TEC_4_A: HEADERSchDoc (H1.4), TECS_DRIVER (C127.2 C131.2 C132.2 U18.8,9)
TEC_4_ADC: TECS_DRIVER (R141.2), MCU (U19.18)
TEC_4_B: HEADERSchDoc (H1.2), TECS_DRIVER (C132.1 C134.2 L8.2 U18.12)
TEC_4_~{CS}: TECS_DRIVER (U18.15), MCU (U19.88)
TEC_4_EN: TECS_DRIVER (R74.1), MCU (U19.80)
TEC_4_SWEN: TECS_DRIVER (R97.1), MCU (U19.87)
TEC_MISO: TECS_DRIVER (U15.18 U16.18 U17.18 U18.18), MCU (U19.90)
TEC_MOSI: TECS_DRIVER (U15.17 U16.17 U17.17 U18.17), MCU (U19.91)
TEC_SCK: TECS_DRIVER (U15.16 U16.16 U17.16 U18.16), MCU (U19.89)